# EAGLE design megajoltC (EAGLE 7.2.0)

## Sheet 1 of 6
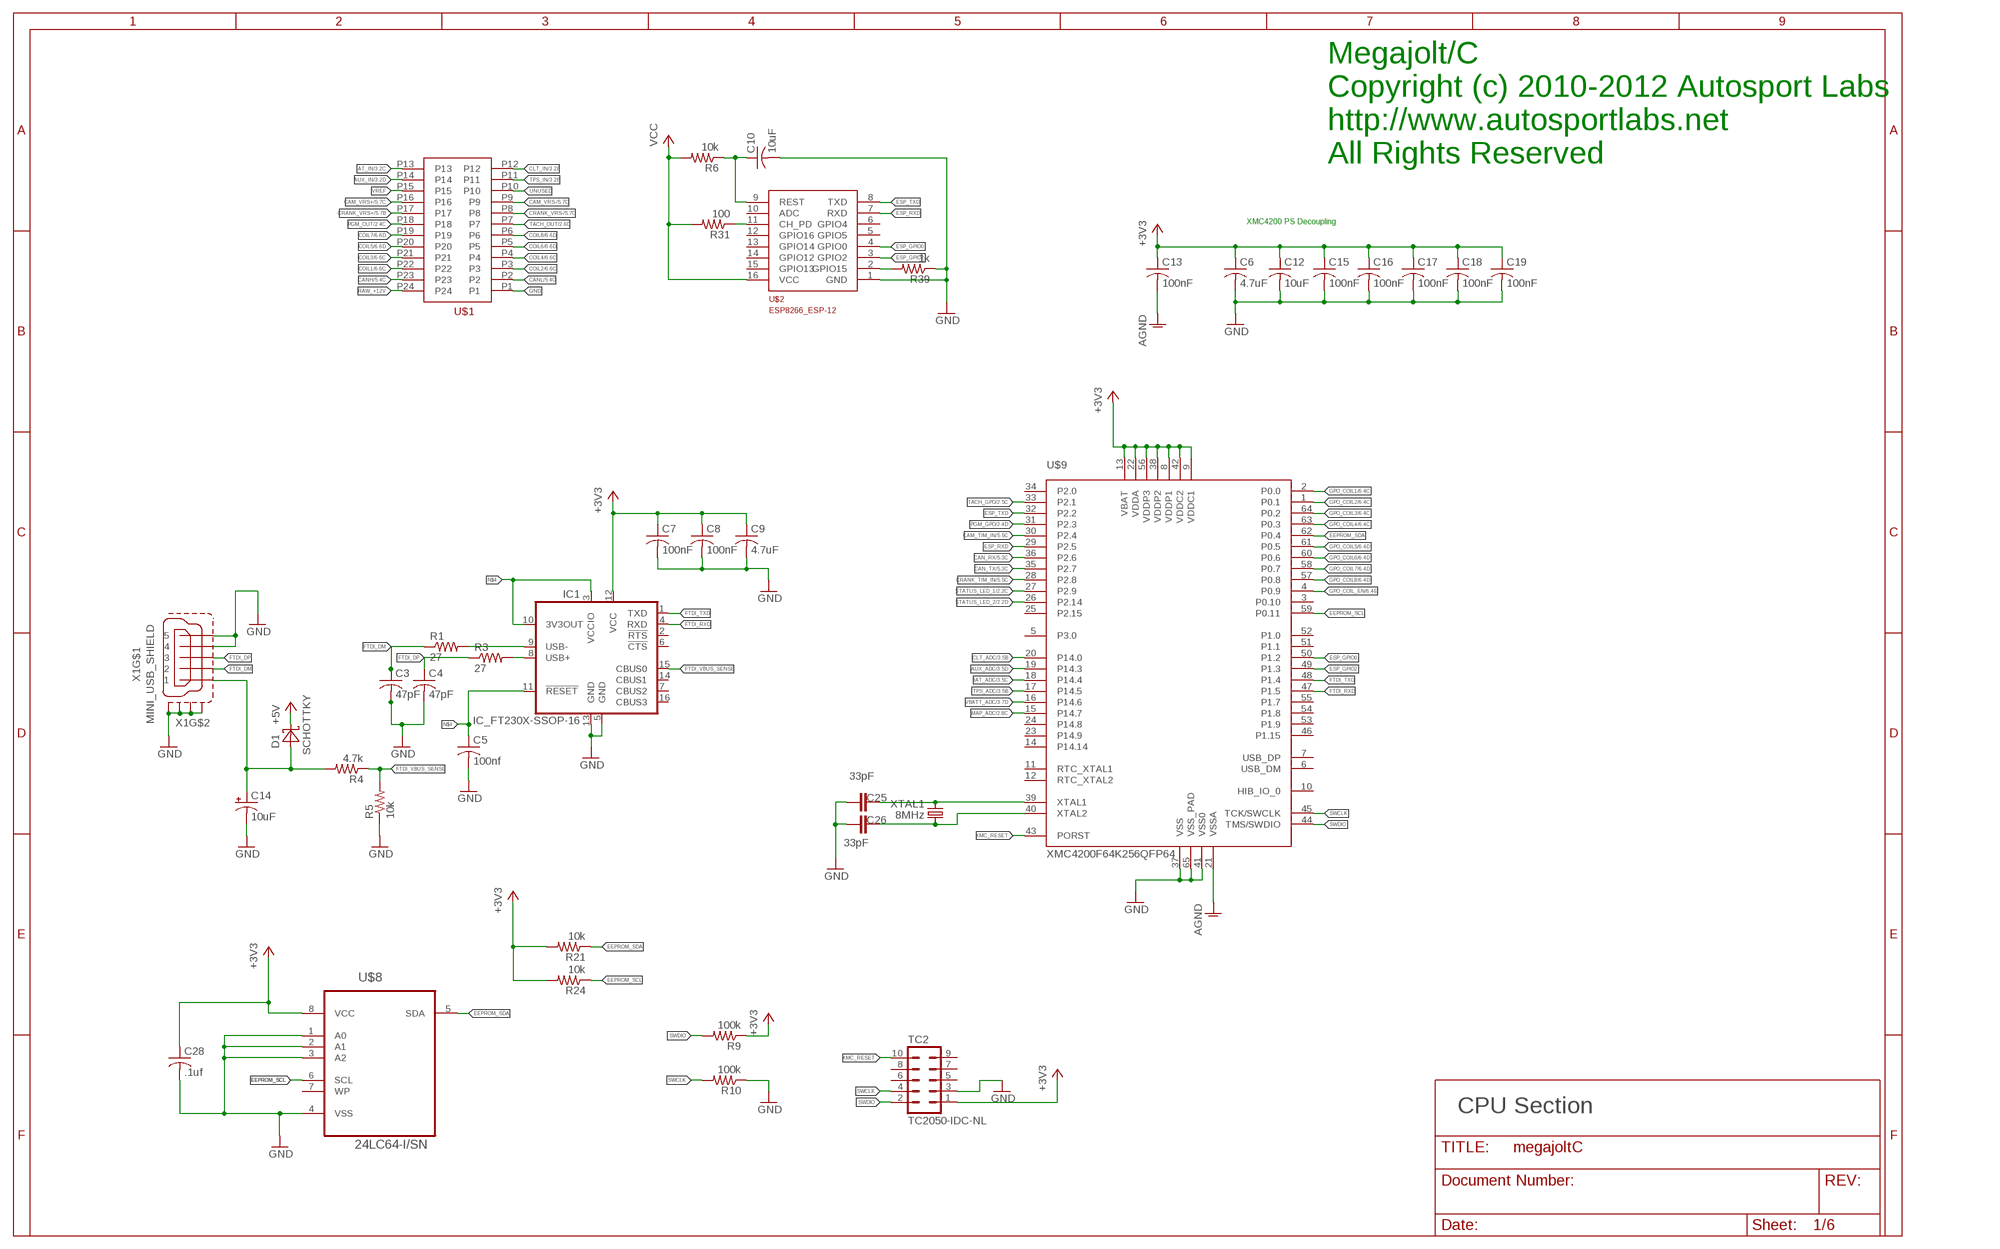
[diagram p0: schematic, sheet 1]

### Parts
C3  47pF  C-USC0603  [C0603]
C4  47pF  C-USC0603  [C0603]
C5  100nf  C-USC0603  [C0603]
C6  4.7uF  C-USC0603  [C0603]
C7  100nF  C-USC0603  [C0603]
C8  100nF  C-USC0603  [C0603]
C9  4.7uF  C-USC0603  [C0603]
C10  10uF  C-USC0603  [C0603]
C12  10uF  C-USC0603  [C0603]
C13  100nF  C-USC0603  [C0603]
C14  10uF  CPOL-USSMCA  [SMC_A]
C15  100nF  C-USC0603  [C0603]
C16  100nF  C-USC0603  [C0603]
C17  100nF  C-USC0603  [C0603]
C18  100nF  C-USC0603  [C0603]
C19  100nF  C-USC0603  [C0603]
C25  33pF  CAP0603  [0603]
C26  33pF  CAP0603  [0603]
C28  .1uf  C-USC0603  [C0603]
D1  SCHOTTKY  [SMA]
IC1  IC_FT230X-SSOP-16  [SSOP-16-FTDI]
R1  27  R-US_R0603  [R0603]
R3  27  R-US_R0603  [R0603]
R4  4.7k  R-US_R0603  [R0603]
R5  10k  R-US_R0603  [R0603]
R6  10k  R-US_R0603  [R0603]
R9  100k  R-US_R0603  [R0603]
R10  100k  R-US_R0603  [R0603]
R21  10k  R-US_R0603  [R0603]
R24  10k  R-US_R0603  [R0603]
R31  100  R-US_R0603  [R0603]
R39  1k  R-US_R0603  [R0603]
TC2  TC2050-IDC-NL  [TC2050-IDC-NL]
U$1  MOLEX_MINIFIT-JR-24  [MOLEX_MINIFIT-JR-24]
U$2  ESP8266_ESP-12  [ESP8266-ESP12]
U$8  24LC64-I/SN  [SOIC127P600X175-8N]
U$9  XMC4200F64K256QFP64  [INF-PG-LQFP-64-5800X5800T28]
X1  MINI_USB_SHIELD  [MINI-USB_JACK]
XTAL1  8MHz  CRYSTAL5X3  [CRYSTAL-SMD-5X3]

### Nets
+3V3: C6.1 C7.1 C8.1 C9.1 C12.1 C13.1 C15.1 C16.1 C17.1 C18.1 C19.1 C28.1 IC1.12(VCC) R9.1 R21.2 R24.2 TC2.1 U$8.8(VCC) U$9.8(VDDP1) U$9.9(VDDC1) U$9.13(VBAT) U$9.22(VDDA) U$9.38(VDDP2) U$9.42(VDDC2) U$9.56(VDDP3) ; also sheet 2,4
+5V: D1.C ; also sheet 2,3,4,5,6
AGND: C13.2 U$9.21(VSSA) ; also sheet 3,4
AUX_ADC: U$9.19(P14.3) ; also sheet 3
AUX_IN: U$1.P14 ; also sheet 3
CAM_TIM_IN: U$9.30(P2.4) ; also sheet 5
CAM_VRS+: U$1.P16 ; also sheet 5
CAM_VRS-: U$1.P9 ; also sheet 5
CAN_RX: U$9.36(P2.6) ; also sheet 5
CAN_TX: U$9.35(P2.7) ; also sheet 5
CANH: U$1.P23 ; also sheet 5
CANL: U$1.P2 ; also sheet 5
CLT_ADC: U$9.20(P14.0) ; also sheet 3
CLT_IN: U$1.P12 ; also sheet 3
COIL1: U$1.P22 ; also sheet 6
COIL2: U$1.P3 ; also sheet 6
COIL3: U$1.P21 ; also sheet 6
COIL4: U$1.P4 ; also sheet 6
COIL5: U$1.P20 ; also sheet 6
COIL6: U$1.P5 ; also sheet 6
COIL7: U$1.P19 ; also sheet 6
COIL8: U$1.P6 ; also sheet 6
CRANK_TIM_IN: U$9.28(P2.8) ; also sheet 5
CRANK_VRS+: U$1.P17 ; also sheet 5
CRANK_VRS-: U$1.P8 ; also sheet 5
EEPROM_SCL: R24.1 U$8.6(SCL) U$9.59(P0.11)
EEPROM_SDA: R21.1 U$8.5(SDA) U$9.62(P0.4)
ESP_GPIO0: U$2.4(GPIO0) U$9.50(P1.2)
ESP_GPIO2: U$2.3(GPIO2) U$9.49(P1.3)
ESP_RXD: U$2.7(RXD) U$9.29(P2.5)
ESP_TXD: U$2.8(TXD) U$9.32(P2.2)
FTDI_DM: C3.1 R1.1 X1.2
FTDI_DP: C4.1 R3.1 X1.3
FTDI_RXD: IC1.4(RXD) U$9.47(P1.5)
FTDI_TXD: IC1.1(TXD) U$9.48(P1.4)
FTDI_VBUS_SENSE: IC1.15(CBUS0) R4.1 R5.2
GND: C3.2 C4.2 C5.2 C6.2 C7.2 C8.2 C9.2 C10.2 C12.2 C14.- C15.2 C16.2 C17.2 C18.2 C19.2 C25.1 C26.1 C28.2 IC1.5(GND) IC1.13(GND) R5.1 R10.1 R39.1 TC2.3 U$1.P1 U$2.1(GND) U$8.1(A0) U$8.2(A1) U$8.3(A2) U$8.4(VSS) U$9.37(VSS) U$9.41(VSS0) U$9.65(VSS_PAD) X1.4 X1.5 X1.M1(S1) X1.M2(S2) X1.M3(S3) X1.M4(S4) ; also sheet 2,4,5,6
GPO_COIL1: U$9.2(P0.0) ; also sheet 6
GPO_COIL2: U$9.1(P0.1) ; also sheet 6
GPO_COIL3: U$9.64(P0.2) ; also sheet 6
GPO_COIL4: U$9.63(P0.3) ; also sheet 6
GPO_COIL5: U$9.61(P0.5) ; also sheet 6
GPO_COIL6: U$9.60(P0.6) ; also sheet 6
GPO_COIL7: U$9.58(P0.7) ; also sheet 6
GPO_COIL8: U$9.57(P0.8) ; also sheet 6
GPO_COIL_EN: U$9.4(P0.9) ; also sheet 6
IAT_ADC: U$9.18(P14.4) ; also sheet 3
IAT_IN: U$1.P13 ; also sheet 3
MAP_ADC: U$9.15(P14.7) ; also sheet 2
N$1: IC1.8(USB+) R3.2
N$3: IC1.9(USB-) R1.2
N$4: C5.1 IC1.3(VCCIO) IC1.10(3V3OUT) IC1.11(!RESET)
N$17: C10.1 R6.1 U$2.9(REST)
N$18: R31.1 U$2.11(CH_PD)
N$21: C26.2 U$9.40(XTAL2) XTAL1.1
N$24: R39.2 U$2.2(GPIO15)
N$25: C25.2 U$9.39(XTAL1) XTAL1.3
PGM_GPO: U$9.31(P2.3) ; also sheet 2
PGM_OUT: U$1.P18 ; also sheet 2
RAW_+12V: U$1.P24 ; also sheet 4
STATUS_LED_1: U$9.27(P2.9) ; also sheet 2
STATUS_LED_2: U$9.26(P2.14) ; also sheet 2
SWCLK: R10.2 TC2.4 U$9.45(TCK/SWCLK)
SWDIO: R9.2 TC2.2 U$9.44(TMS/SWDIO)
TACH_GPO: U$9.33(P2.1) ; also sheet 2
TACH_OUT: U$1.P7 ; also sheet 2
TPS_ADC: U$9.17(P14.5) ; also sheet 3
TPS_IN: U$1.P11 ; also sheet 3
UNUSED: U$1.P10
VBATT_ADC: U$9.16(P14.6) ; also sheet 3
VBUS: C14.+ D1.A R4.2 X1.1
VCC: R6.2 R31.2 U$2.16(VCC) ; also sheet 4
VREF: U$1.P15 ; also sheet 4
XMC_RESET: TC2.10 U$9.43(PORST)
Unconnected: IC1.2(!RTS) IC1.6(!CTS) IC1.7(CBUS2) IC1.14(CBUS1) IC1.16(CBUS3) TC2.5 TC2.6 TC2.7 TC2.8 TC2.9 U$2.5(GPIO5) U$2.6(GPIO4) U$2.10(ADC) U$2.12(GPIO16) U$2.13(GPIO14) U$2.14(GPIO12) U$2.15(GPIO13) U$8.7(WP) U$9.3(P0.10) U$9.5(P3.0) U$9.6(USB_DM) U$9.7(USB_DP) U$9.10(HIB_IO_0) U$9.11(RTC_XTAL1) U$9.12(RTC_XTAL2) U$9.14(P14.14) U$9.23(P14.9) U$9.24(P14.8) U$9.25(P2.15) U$9.34(P2.0) U$9.46(P1.15) U$9.51(P1.1) U$9.52(P1.0) U$9.53(P1.9) U$9.54(P1.8) U$9.55(P1.7)

### Notes on the sheet
- Megajolt/C
- Copyright (c) 2010-2012 Autosport Labs
- http://www.autosportlabs.net
- All Rights Reserved
- XMC4200 PS Decoupling
- CPU Section

## Sheet 2 of 6
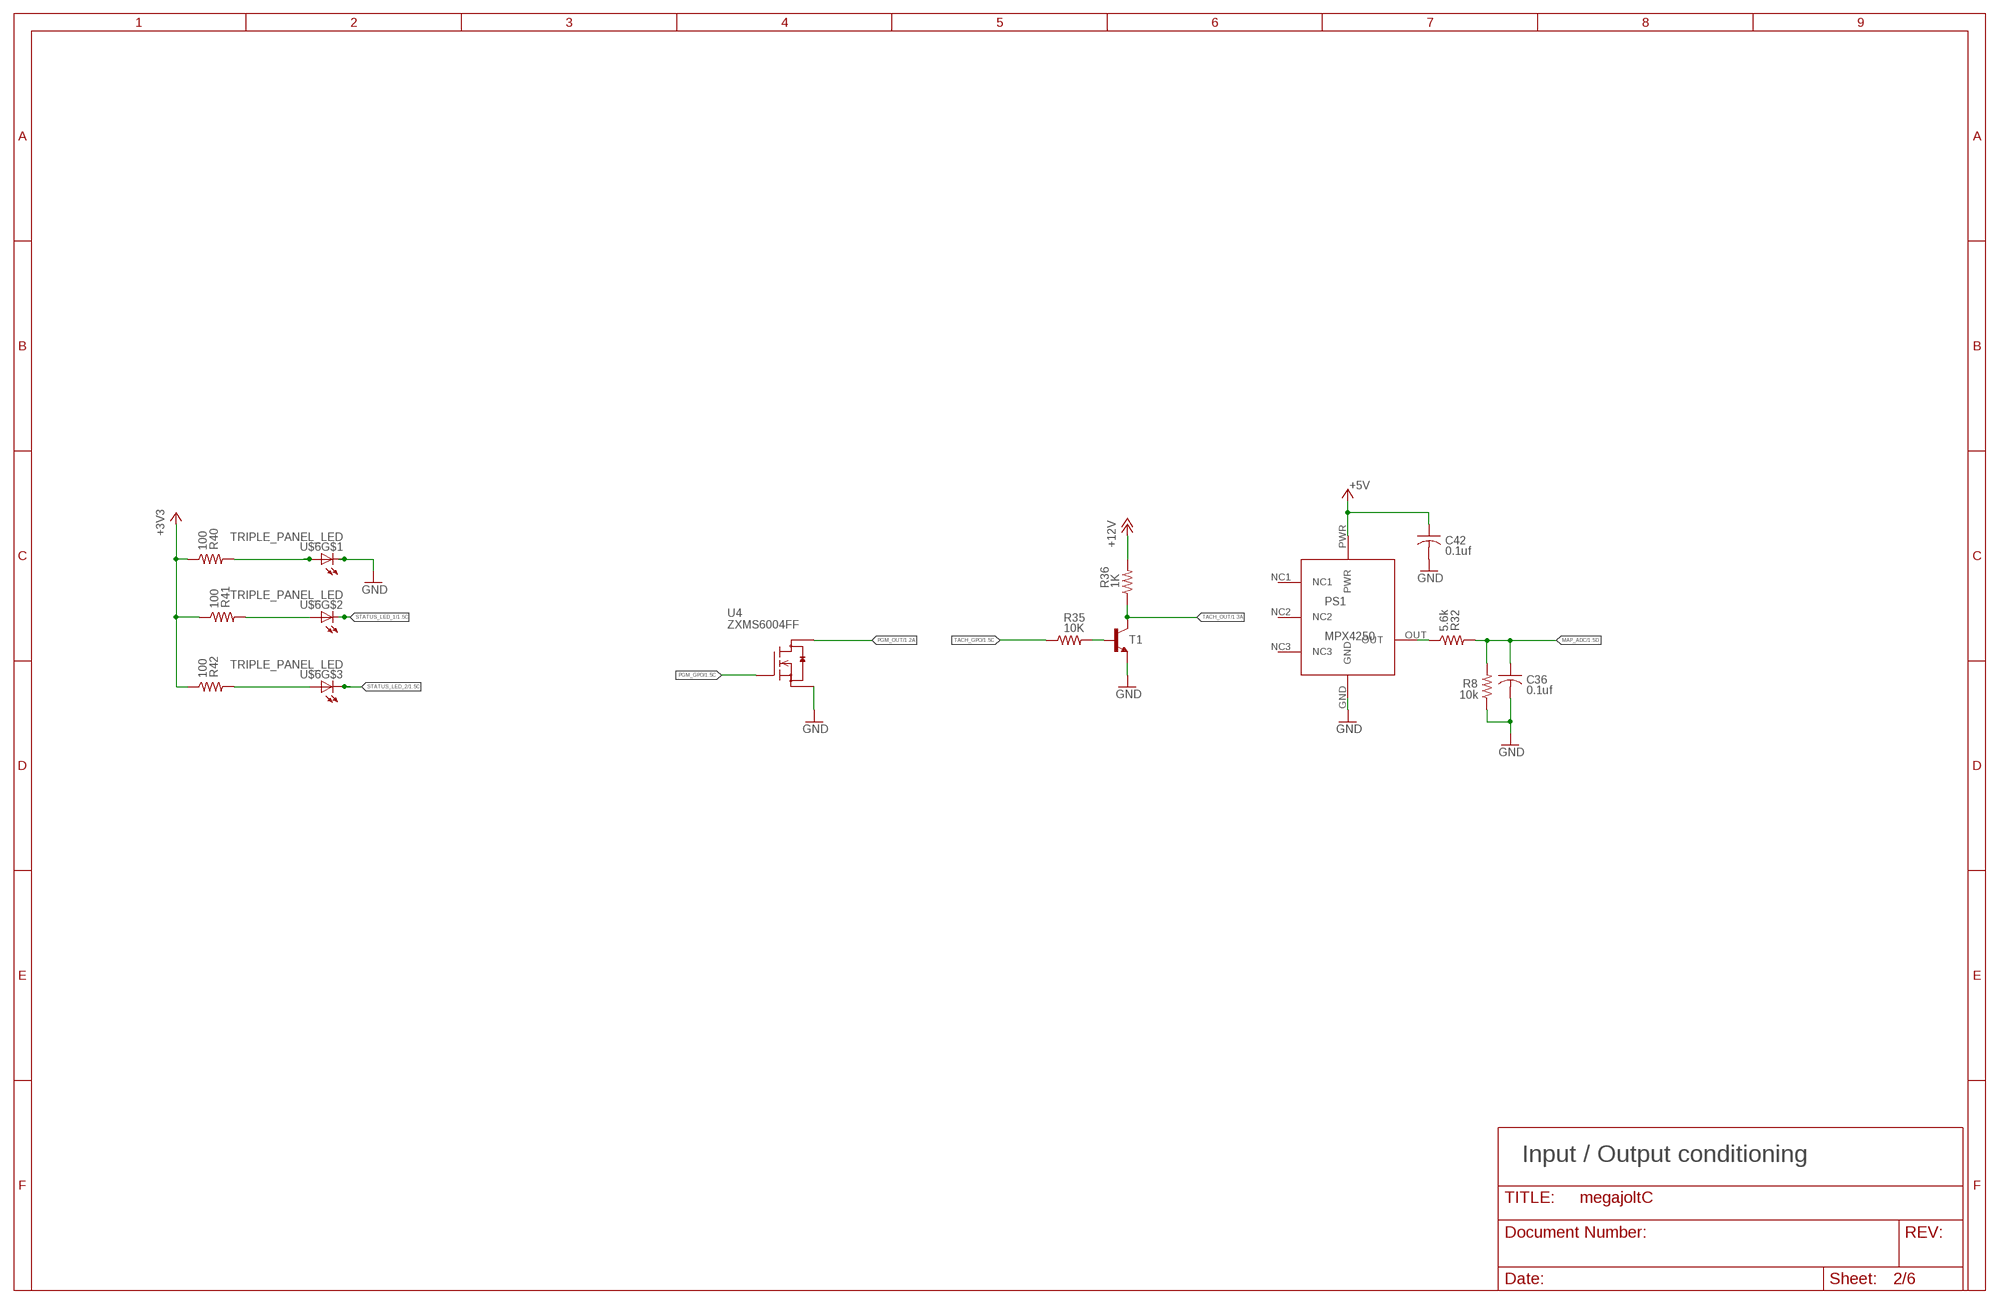
[diagram p1: schematic, sheet 2]

### Parts
C36  0.1uf  C-USC0603  [C0603]
C42  0.1uf  C-USC0603  [C0603]
PS1  MPX4250  [MPX4250]
R8  10k  R-US_R0603  [R0603]
R32  5.6k  R-US_R0603  [R0603]
R35  10K  R-US_R0603  [R0603]
R36  1K  R-US_R0603  [R0603]
R40  100  R-US_R0603  [R0603]
R41  100  R-US_R0603  [R0603]
R42  100  R-US_R0603  [R0603]
T1  -NPN-SOT23-EBC  [SOT23-EBC]
U4  ZXMS6004FF  [SOT-23]
U$6  TRIPLE_PANEL_LED  [RIGHT_ANGLE_3_LEDS_DEEP]

### Nets
+3V3: R40.1 R41.1 R42.1 ; also sheet 1,4
+5V: C42.1 PS1.PWR ; also sheet 1,3,4,5,6
GND: C36.2 C42.2 PS1.GND R8.1 T1.E U4.2(S1) U$6.2(C) ; also sheet 1,4,5,6
MAP_ADC: C36.1 R8.2 R32.2 ; also sheet 1
N$7: PS1.OUT R32.1
N$16: R35.2 T1.B
N$20: R40.2 U$6.1(A)
N$22: R41.2 U$6.3(A)
N$23: R42.2 U$6.5(A)
PGM_GPO: U4.1(G) ; also sheet 1
PGM_OUT: U4.3(D1) ; also sheet 1
SAFE_+12V: R36.2 ; supply symbol labelled +12V ; also sheet 3,4
STATUS_LED_1: U$6.4(C) ; also sheet 1
STATUS_LED_2: U$6.6(C) ; also sheet 1
TACH_GPO: R35.1 ; also sheet 1
TACH_OUT: R36.1 T1.C ; also sheet 1

### Notes on the sheet
- Input / Output conditioning

## Sheet 3 of 6
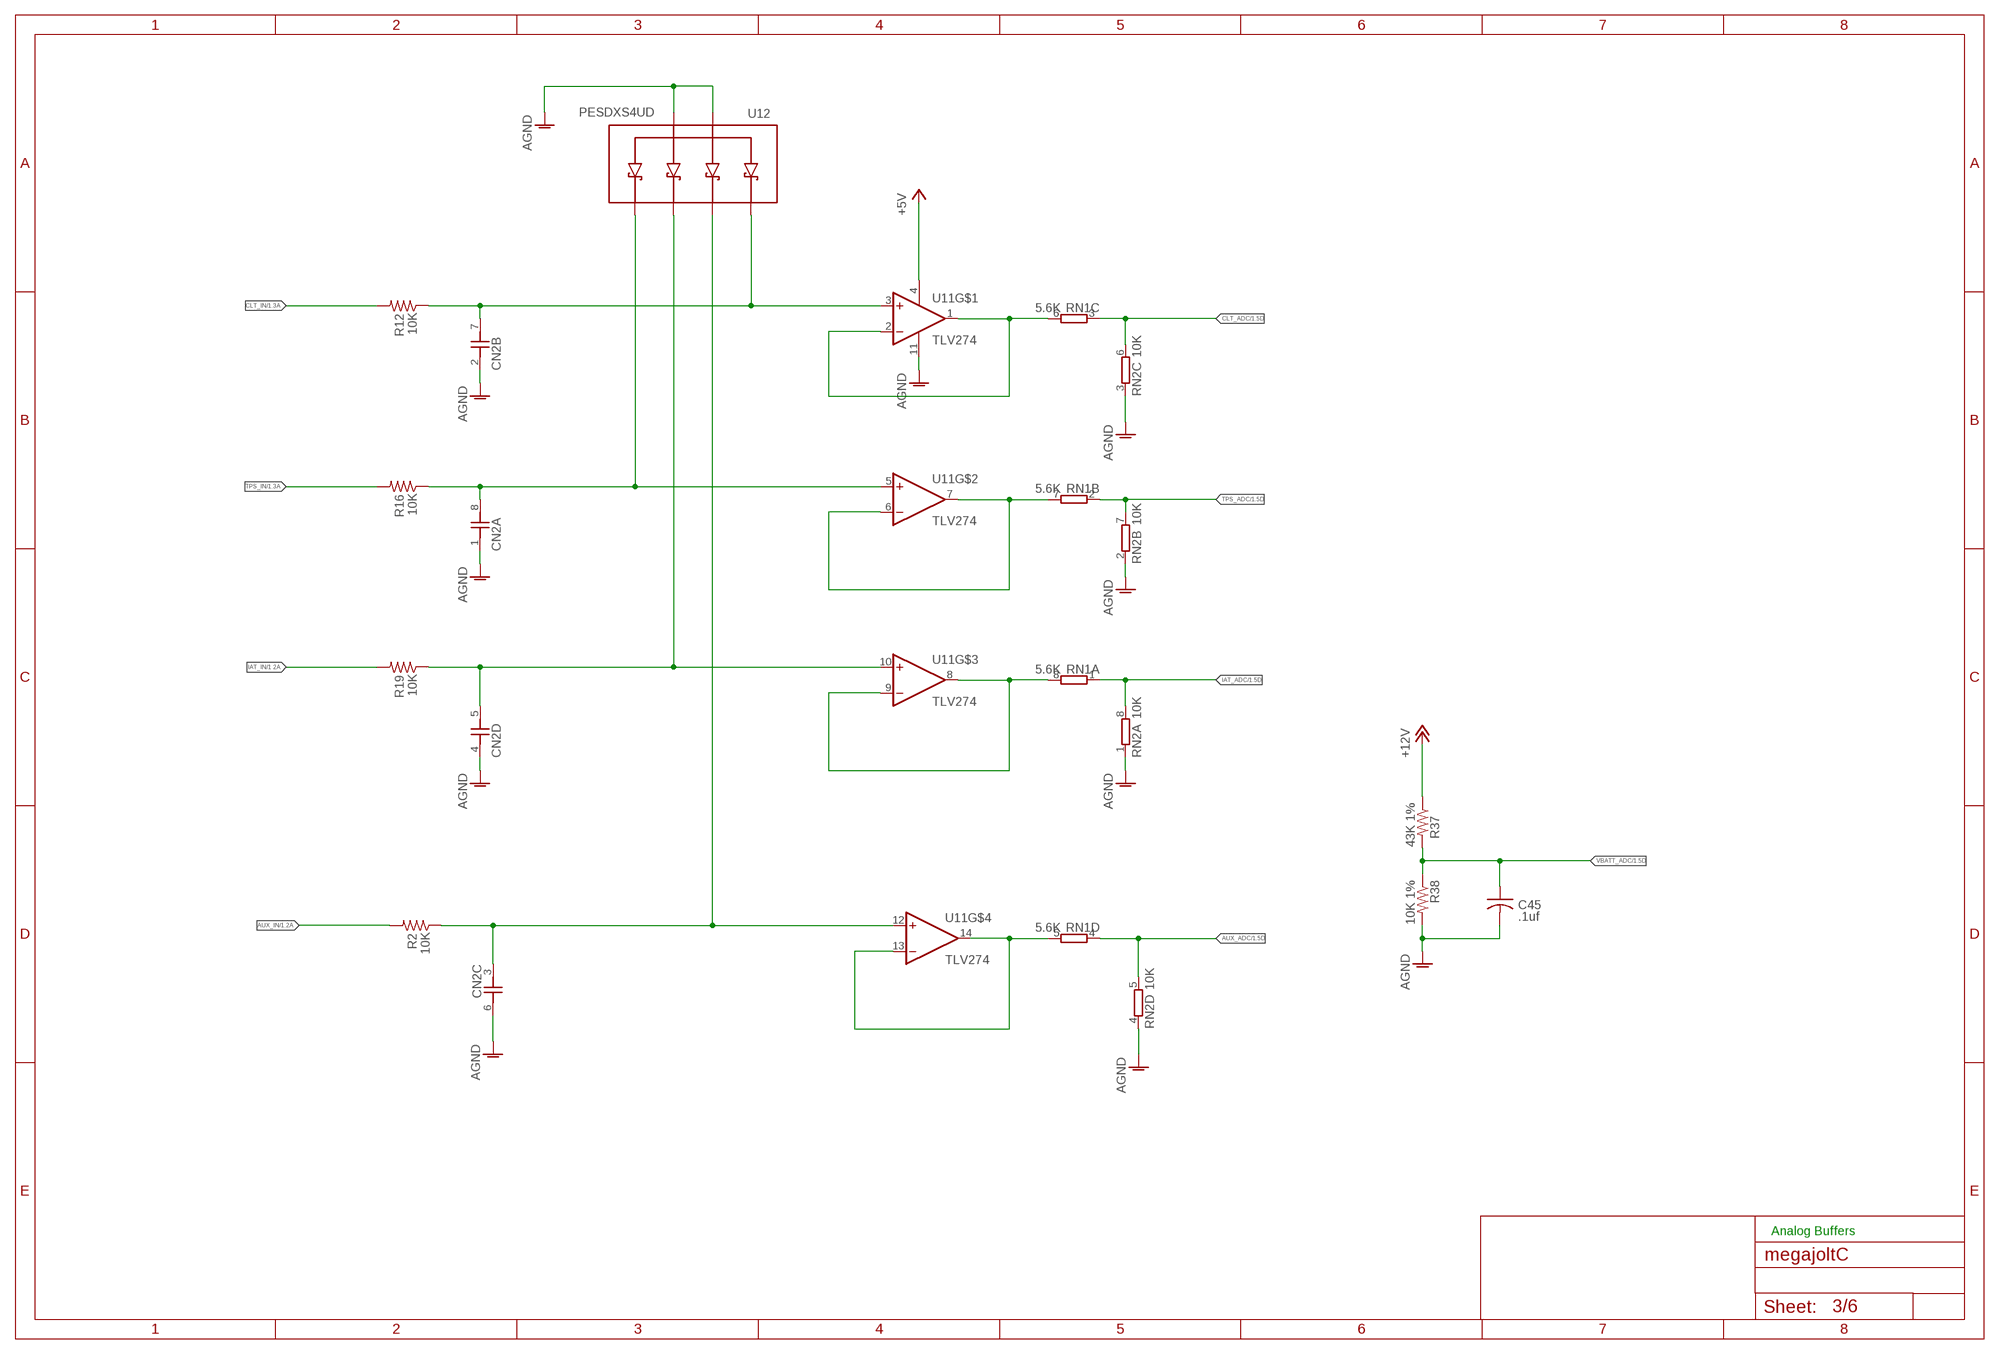
[diagram p2: schematic, sheet 3]

### Parts
C45  .1uf  C-USC0603  [C0603]
CN2  CAP_ARRAY_41206_ARRAY  [1206_ARRAY]
R2  10K  R-US_R1206  [R1206]
R12  10K  R-US_R1206  [R1206]
R16  10K  R-US_R1206  [R1206]
R19  10K  R-US_R1206  [R1206]
R37  43K 1%  R-US_R0603  [R0603]
R38  10K 1%  R-US_R0603  [R0603]
RN1  5.6K  4R-N0603-ARC  [0603-ARC]
RN2  10K  4R-N0603-ARC  [0603-ARC]
U11  TLV274  TLV274SO14  [SO14]
U12  PESDXS4UD  [SC-74]

### Nets
+5V: U11.4(V+) ; also sheet 1,2,4,5,6
AGND: C45.2 CN2.1 CN2.2 CN2.4 CN2.6 R38.2 RN2.1 RN2.2 RN2.3 RN2.4 U11.11(V-) U12.2 U12.5 ; also sheet 1,4
ANALOG-FREQ_1_OPAMP_OUT1: RN1.6 U11.1(OUT) U11.2(-IN)
ANALOG-FREQ_1_OPAMP_OUT2: RN1.7 U11.6(-IN) U11.7(OUT)
ANALOG-FREQ_1_OPAMP_OUT3: RN1.8 U11.8(OUT) U11.9(-IN)
AUX_ADC: RN1.4 RN2.5 ; also sheet 1
AUX_IN: R2.2 ; also sheet 1
CLT_ADC: RN1.3 RN2.6 ; also sheet 1
CLT_IN: R12.2 ; also sheet 1
IAT_ADC: RN1.1 RN2.8 ; also sheet 1
IAT_IN: R19.2 ; also sheet 1
N$14: RN1.5 U11.13(-IN) U11.14(OUT)
N$26: CN2.7 R12.1 U11.3(+IN) U12.1
N$28: CN2.8 R16.1 U11.5(+IN) U12.6
N$30: CN2.5 R19.1 U11.10(+IN) U12.4
N$31: CN2.3 R2.1 U11.12(+IN) U12.3
SAFE_+12V: R37.1 ; supply symbol labelled +12V ; also sheet 2,4
TPS_ADC: RN1.2 RN2.7 ; also sheet 1
TPS_IN: R16.2 ; also sheet 1
VBATT_ADC: C45.1 R37.2 R38.1 ; also sheet 1

### Notes on the sheet
- Analog Buffers

## Sheet 4 of 6
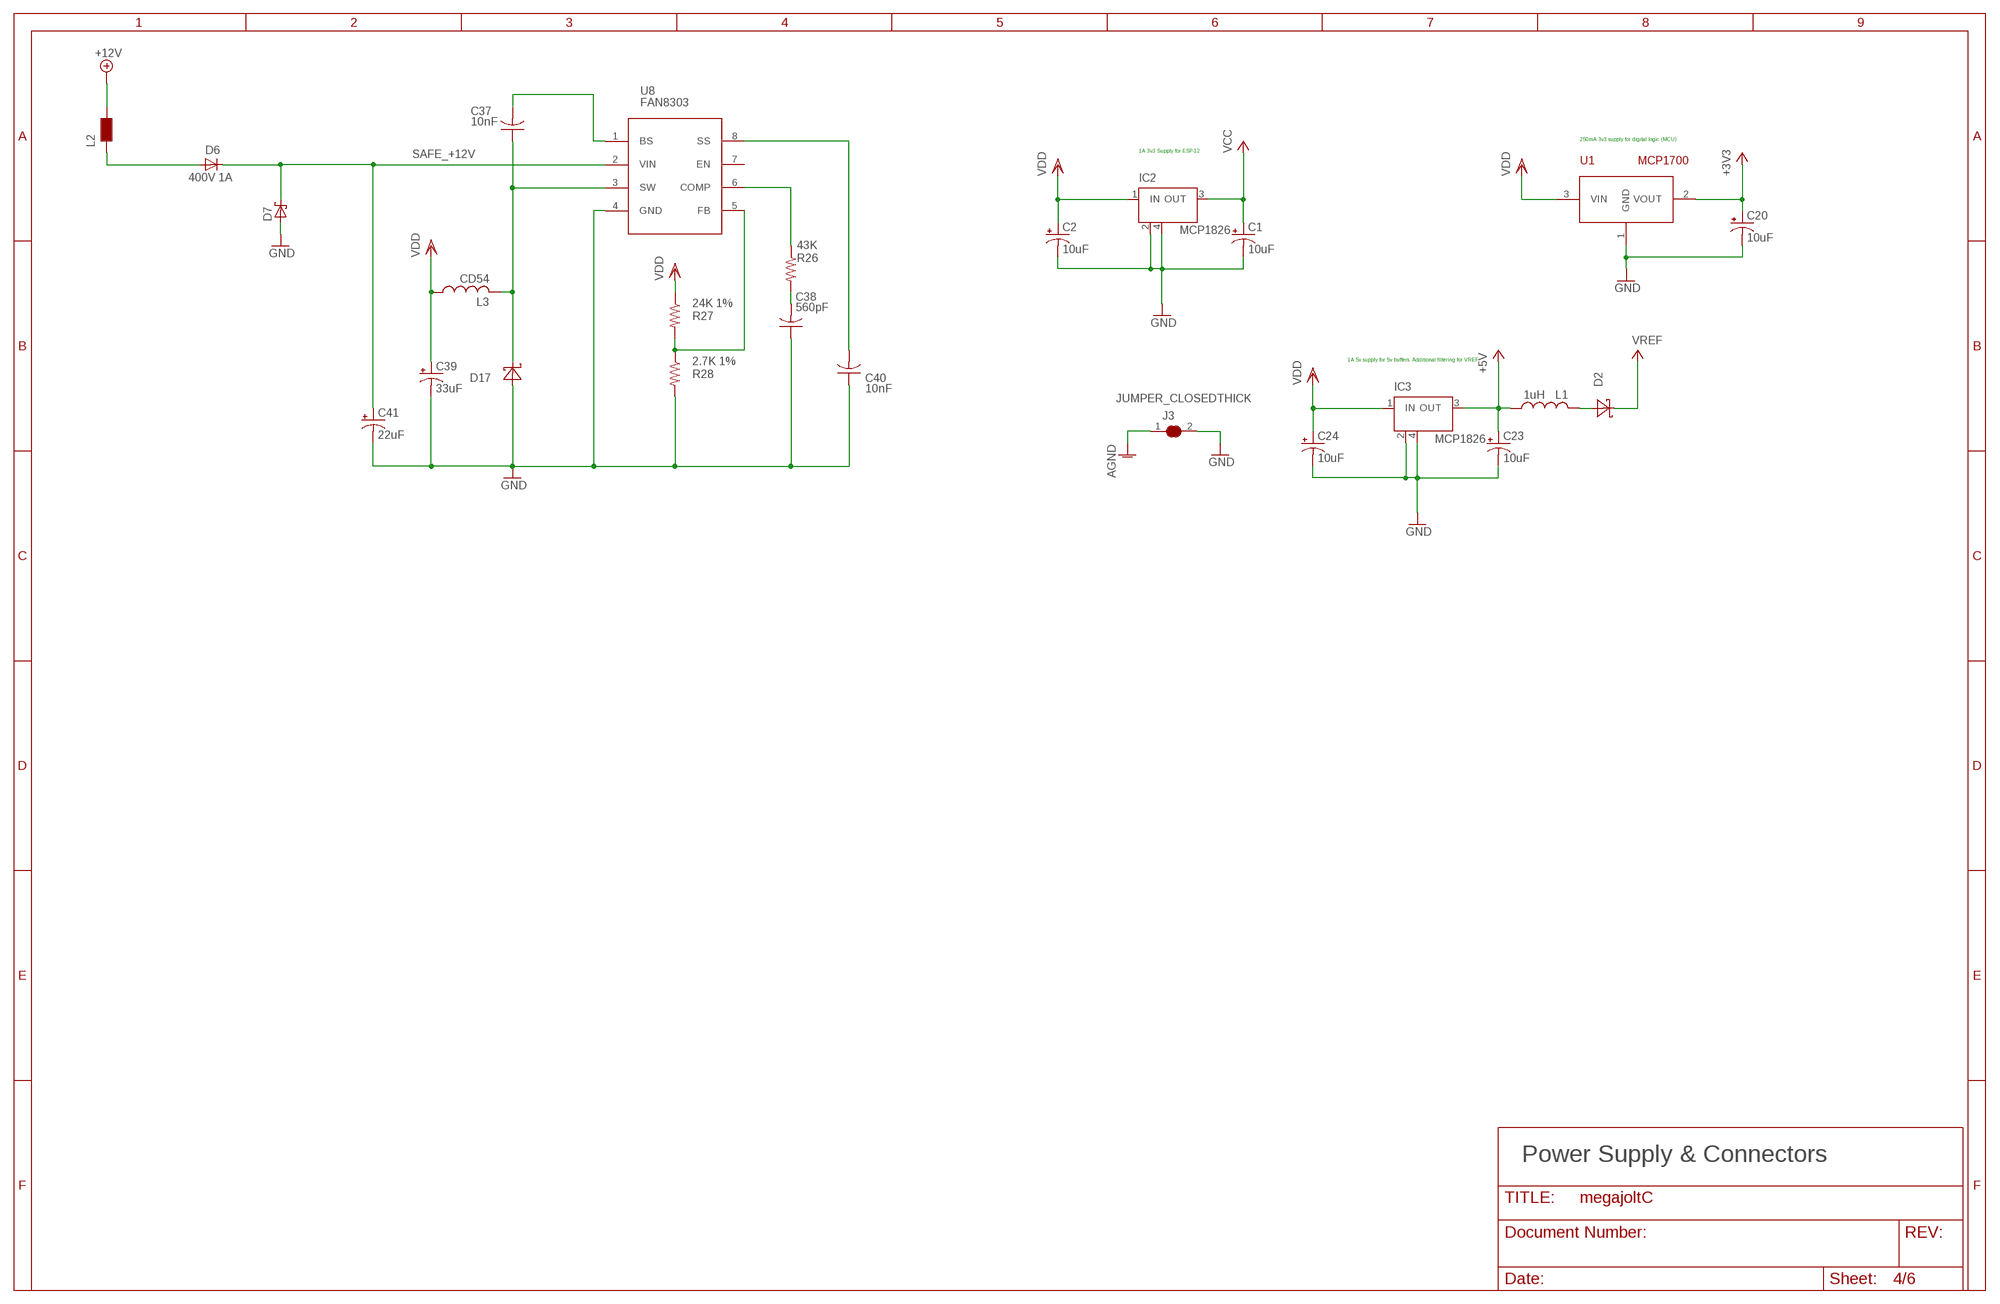
[diagram p3: schematic, sheet 4]

### Parts
C1  10uF  CPOL-USSMCA  [SMC_A]
C2  10uF  CPOL-USSMCA  [SMC_A]
C20  10uF  CPOL-USSMCA  [SMC_A]
C23  10uF  CPOL-USSMCA  [SMC_A]
C24  10uF  CPOL-USSMCA  [SMC_A]
C37  10nF  C-USC0603  [C0603]
C38  560pF  C-USC0603  [C0603]
C39  33uF  CPOL-USSMCD  [SMC_D]
C40  10nF  C-USC0603  [C0603]
C41  22uF  CPOL-US153CLV-0605  [153CLV-0605]
D2  SCHOTTKY  [SMA]
D6  400V 1A  DIODE1  [SMA]
D7  SCHOTTKY-DIODESMC  [SMC]
D17  SCHOTTKY  [SMA]
IC2  MCP1826  LM340S  [SOT223]
IC3  MCP1826  LM340S  [SOT223]
J3  JUMPER_CLOSEDTHICK  [JUMPER_CLOSED_THICK]
L1  1uH  INDUCTOR  [1210]
L2  WE-CBF_1812  [1812]
L3  CD54  [CD54]
R26  43K  R-US_R0603  [R0603]
R27  24K 1%  R-US_R0603  [R0603]
R28  2.7K 1%  R-US_R0603  [R0603]
U1  MCP1700  [SOT-23]
U8  FAN8303  [SO-8]

### Nets
+3V3: C20.+ U1.2(VOUT) ; also sheet 1,2
+5V: C23.+ IC3.3(OUT) L1.1 ; also sheet 1,2,3,5,6
AGND: J3.1 ; also sheet 1,3
GND: C1.- C2.- C20.- C23.- C24.- C38.1 C39.- C40.1 C41.- D7.A D17.A IC2.2(GND) IC2.4(GND) IC3.2(GND) IC3.4(GND) J3.2 R28.2 U1.1(GND) U8.4(GND) ; also sheet 1,2,5,6
N$2: D2.A L1.2
N$8: R27.2 R28.1 U8.5(FB)
N$9: C37.2 U8.1(BS)
N$10: C37.1 D17.C L3.P$2 U8.3(SW)
N$11: C38.2 R26.2
N$12: R26.1 U8.6(COMP)
N$13: C40.2 U8.8(SS)
N$15: D6.A L2.1
RAW_+12V: L2.2 ; supply symbol labelled +12V ; also sheet 1
SAFE_+12V: C41.+ D6.C D7.C U8.2(VIN) ; also sheet 2,3
VCC: C1.+ IC2.3(OUT) ; also sheet 1
VDD: C2.+ C24.+ C39.+ IC2.1(IN) IC3.1(IN) L3.P$1 R27.1 U1.3(VIN)
VREF: D2.C ; also sheet 1
Unconnected: U8.7(EN)

### Notes on the sheet
- 250mA 3v3 supply for digital logic (MCU)
- 1A 3v3 Supply for ESP-12
- 1A 5v supply for 5v buffers. Additional filtering for VREF
- Power Supply & Connectors

## Sheet 5 of 6
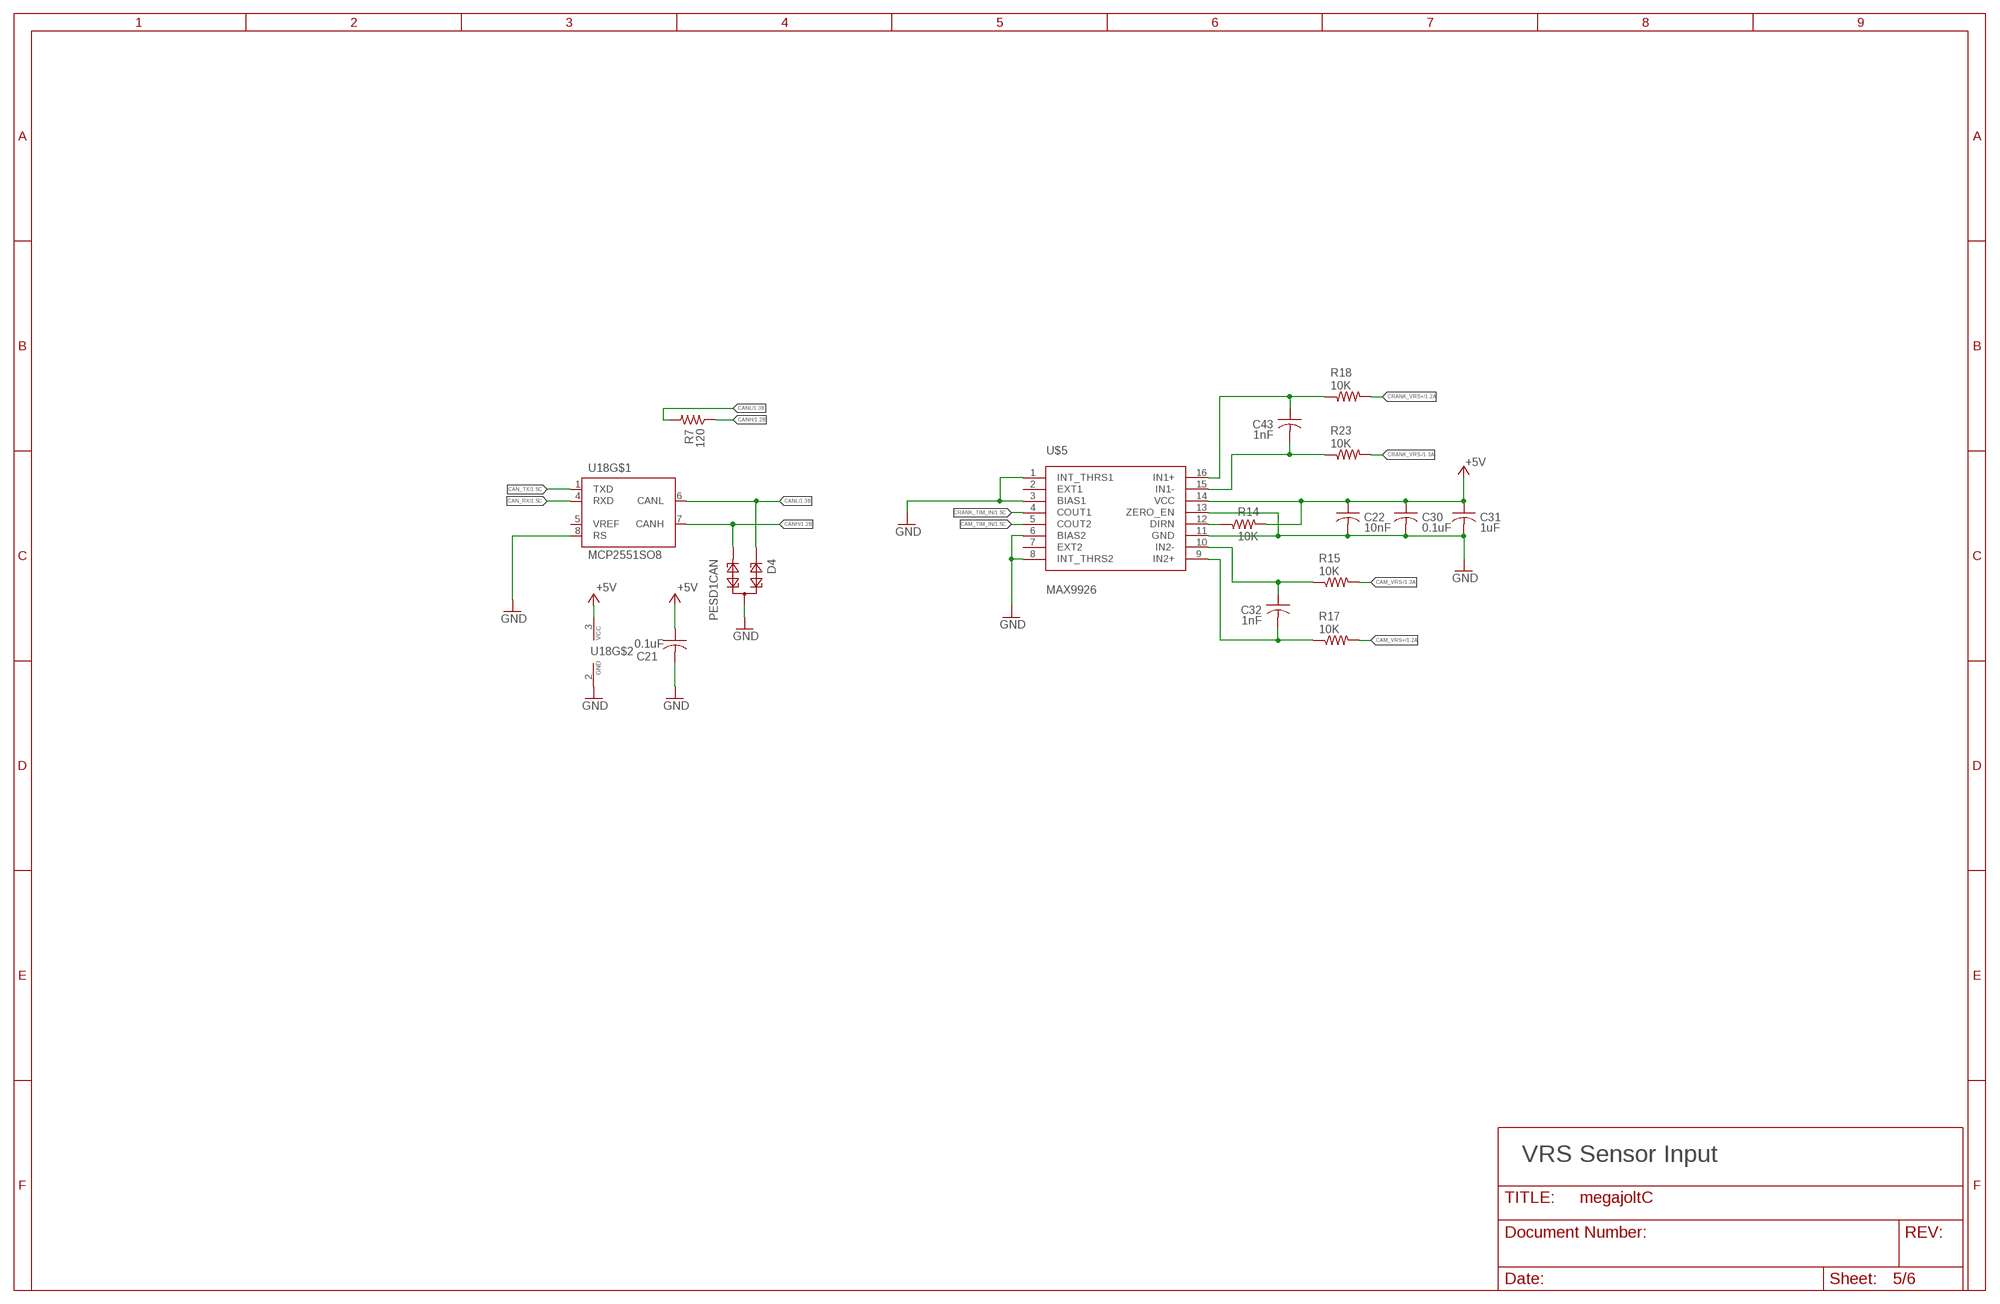
[diagram p4: schematic, sheet 5]

### Parts
C21  0.1uF  C-USC0603K  [C0603K]
C22  10nF  C-USC0603  [C0603]
C30  0.1uF  C-USC0603  [C0603]
C31  1uF  C-USC0603  [C0603]
C32  1nF  C-USC0603  [C0603]
C43  1nF  C-USC0603  [C0603]
D4  PESD1CAN  [SOT23]
R7  120  R-US_R0603  [R0603]
R14  10K  R-US_R0603  [R0603]
R15  10K  R-US_R0603  [R0603]
R17  10K  R-US_R0603  [R0603]
R18  10K  R-US_R0603  [R0603]
R23  10K  R-US_R0603  [R0603]
U18  MCP2551SO8  [SO08]
U$5  MAX9926  [QSOP16]

### Nets
+5V: C21.1 C22.1 C30.1 C31.1 R14.2 U18.3(VCC) U$5.14(VCC) ; also sheet 1,2,3,4,6
CAM_TIM_IN: U$5.5(COUT2) ; also sheet 1
CAM_VRS+: R17.2 ; also sheet 1
CAM_VRS-: R15.2 ; also sheet 1
CAN_RX: U18.4(RXD) ; also sheet 1
CAN_TX: U18.1(TXD) ; also sheet 1
CANH: D4.2 R7.1 U18.7(CANH) ; also sheet 1
CANL: D4.1 R7.2 U18.6(CANL) ; also sheet 1
CRANK_TIM_IN: U$5.4(COUT1) ; also sheet 1
CRANK_VRS+: R18.2 ; also sheet 1
CRANK_VRS-: R23.2 ; also sheet 1
GND: C21.2 C22.2 C30.2 C31.2 D4.3 U18.2(GND) U18.8(RS) U$5.1(INT_THRS1) U$5.3(BIAS1) U$5.6(BIAS2) U$5.8(INT_THRS2) U$5.11(GND) U$5.13(ZERO_EN) ; also sheet 1,2,4,6
MAX_DIRN: R14.1 U$5.12(DIRN)
N$27: C43.1 R18.1 U$5.16(IN1+)
N$29: C32.1 R15.1 U$5.10(IN2-)
N$32: C32.2 R17.1 U$5.9(IN2+)
N$33: C43.2 R23.1 U$5.15(IN1-)
Unconnected: U18.5(VREF) U$5.2(EXT1) U$5.7(EXT2)

### Notes on the sheet
- VRS Sensor Input

## Sheet 6 of 6
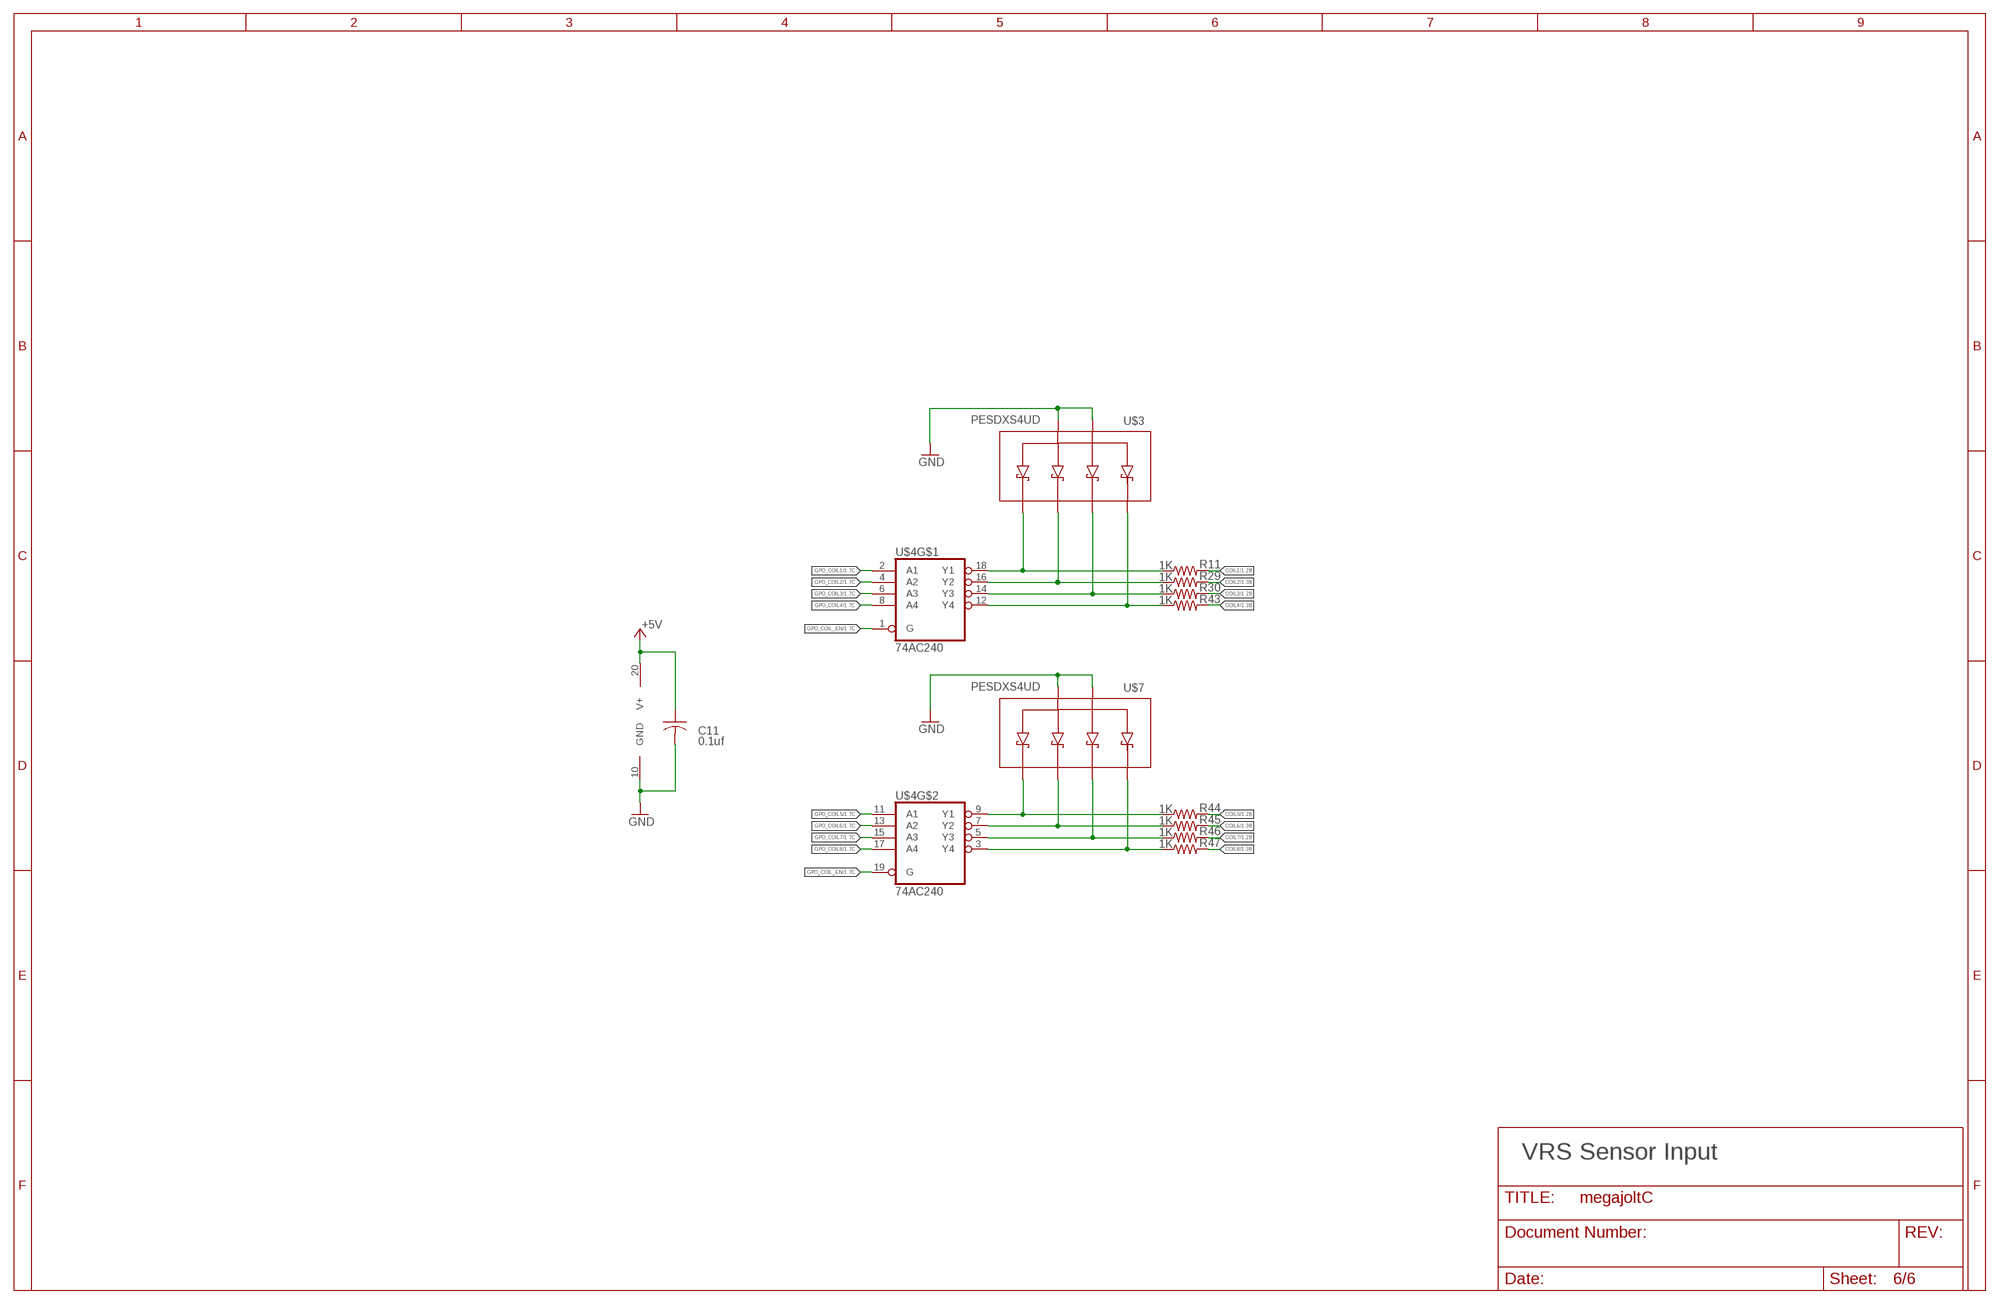
[diagram p5: schematic, sheet 6]

### Parts
C11  0.1uf  C-USC0603  [C0603]
R11  1K  R-US_R0603  [R0603]
R29  1K  R-US_R0603  [R0603]
R30  1K  R-US_R0603  [R0603]
R43  1K  R-US_R0603  [R0603]
R44  1K  R-US_R0603  [R0603]
R45  1K  R-US_R0603  [R0603]
R46  1K  R-US_R0603  [R0603]
R47  1K  R-US_R0603  [R0603]
U$3  PESDXS4UD  [SC-74]
U$4  74AC240  [TSSOP-20]
U$7  PESDXS4UD  [SC-74]

### Nets
+5V: C11.1 U$4.20(V+) ; also sheet 1,2,3,4,5
COIL1: R11.2 ; also sheet 1
COIL2: R29.2 ; also sheet 1
COIL3: R30.2 ; also sheet 1
COIL4: R43.2 ; also sheet 1
COIL5: R44.2 ; also sheet 1
COIL6: R45.2 ; also sheet 1
COIL7: R46.2 ; also sheet 1
COIL8: R47.2 ; also sheet 1
GND: C11.2 U$3.2 U$3.5 U$4.10(GND) U$7.2 U$7.5 ; also sheet 1,2,4,5
GPO_COIL1: U$4.2(A1) ; also sheet 1
GPO_COIL2: U$4.4(A2) ; also sheet 1
GPO_COIL3: U$4.6(A3) ; also sheet 1
GPO_COIL4: U$4.8(A4) ; also sheet 1
GPO_COIL5: U$4.11(A1) ; also sheet 1
GPO_COIL6: U$4.13(A2) ; also sheet 1
GPO_COIL7: U$4.15(A3) ; also sheet 1
GPO_COIL8: U$4.17(A4) ; also sheet 1
GPO_COIL_EN: U$4.1(G) U$4.19(G) ; also sheet 1
N$36: R11.1 U$3.6 U$4.18(Y1)
N$37: R29.1 U$3.4 U$4.16(Y2)
N$38: R30.1 U$3.3 U$4.14(Y3)
N$39: R43.1 U$3.1 U$4.12(Y4)
N$40: R44.1 U$4.9(Y1) U$7.6
N$41: R45.1 U$4.7(Y2) U$7.4
N$42: R46.1 U$4.5(Y3) U$7.3
N$43: R47.1 U$4.3(Y4) U$7.1

### Notes on the sheet
- VRS Sensor Input

## Power pins joined to a net without a drawn wire
NC1: PS1.NC1
NC2: PS1.NC2
NC3: PS1.NC3

## Library data of the parts
C1 C2 C14 C20 C23 C24 C39 C41 = rcl:CPOL-US: POLARIZED CAPACITOR, American symbol
C3-C10 C12 C13 C15-C19 C28 = resistor:C-US: CAPACITOR, American symbol
C11 C21 C22 C30-C32 C36-C38 C40 C42 C43 C45 = rcl:C-US: CAPACITOR, American symbol
C25 C26 = SparkFun:CAP: Capacitor Standard 0603 ceramic capacitor, and 0.1" leaded capacitor.
CN2 = cap_array:CAP_ARRAY_4
D1 D2 D17 = smt_diodes:SCHOTTKY
D4 = diode:PESD1CAN: CAN bus ESD protection diode Source: http://www.nxp.com/documents/data_sheet/PESD1CAN.pdf
D6 = smt_diodes:DIODE
D7 = diode:SCHOTTKY-DIODE: Schottky Diode
IC1 = dp_devices:IC_FT230X: BASIC USB to UART IC
IC2 IC3 = linear:LM340S: 3-Terminal Positive Regulators Source: http://cache.national.com/ds/LM/LM340.pdf
J3 = jumpers:JUMPER_CLOSED
L1 = smt_inductors:INDUCTOR
L2 = wuerth-elektronik:WE-CBF: SMD EMI Suppression Ferrite Beads - excellent anti-EMI properties - low DCR - impedances till 3000 ohms - rated current up to 6 A
L3 = sumida_inductors:CD54
PS1 = pressure_sensor:MPX4250
R1 R3-R6 R9 R10 R21 R24 R31 R39 = resistor:R-US_: RESISTOR, American symbol
R2 R7 R8 R11 R12 R14-R19 R23 R26-R30 R32 R35-R38 R40-R47 = rcl:R-US_: RESISTOR, American symbol
RN1 RN2 = resistor-dil:4R-N: Array Chip Resistor Source: RS Component / Phycomp
T1 = transistor:*-NPN-: NPN Transistror BF959 corrected 2008.03.06
TC2 = TagConnect:TC2050-IDC: Tag-Connect In Circuit Programming & Debug Cable 10 Pin http://www.tag-connect.com
U1 = mcp1700:MCP1700
U4 = power_mosfets:ZXMS6004FF
U8 = voltage_regulators:FAN8303
U11 = op_amps:TLV274
U12 U$3 U$7 = smt_diodes:PESDXS4UD
U18 = can:MCP2551: CAN Tranceiver Microchip
U$1 = molex_mini-fit:MOLEX_MINIFIT-JR-24
U$2 = ESP8266-ESP12:ESP8266_ESP-12
U$4 = dp_devices:74AC240
U$5 = max9924_9927:MAX9926: Maxim MAX9926 dual channel VR Controller
U$6 = LEDs:TRIPLE_PANEL_LED
U$8 = element14_microchip:24LC64-I/SN: 64K I2C Serial EEPROM; MPN: 24LC64-I/SN; OC_FARNELL: 9758070; OC_NEWARK: 12C2020; PACKAGE: SOIC-8; SUPPLIER: MICROCHIP
U$9 = infineon_xmc:XMC4200F64K256
X1 = cnkls_parts:MINI_USB_SHIELD
XTAL1 = SparkFun2:CRYSTAL: Crystals Various standard crystals. Proven footprints. Spark Fun Electronics SKU : COM-00534

## Net classes
0 default: width 0.127 mm, drill 0.254 mm, clearance 0.127 mm

## Board
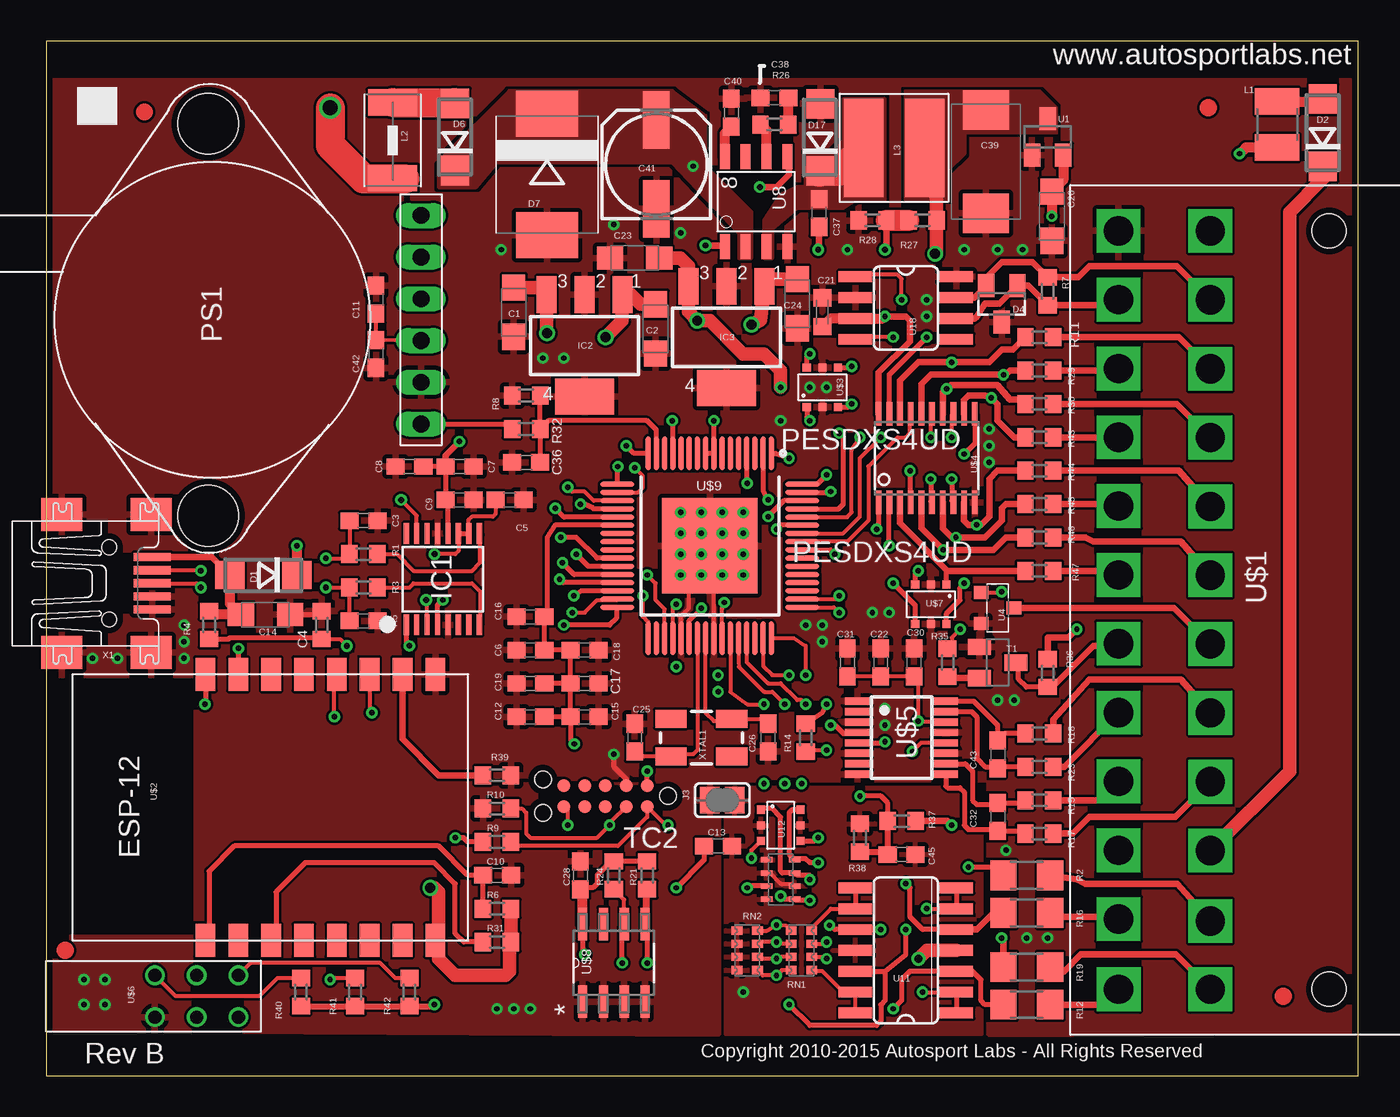
[diagram p6: board, top side]
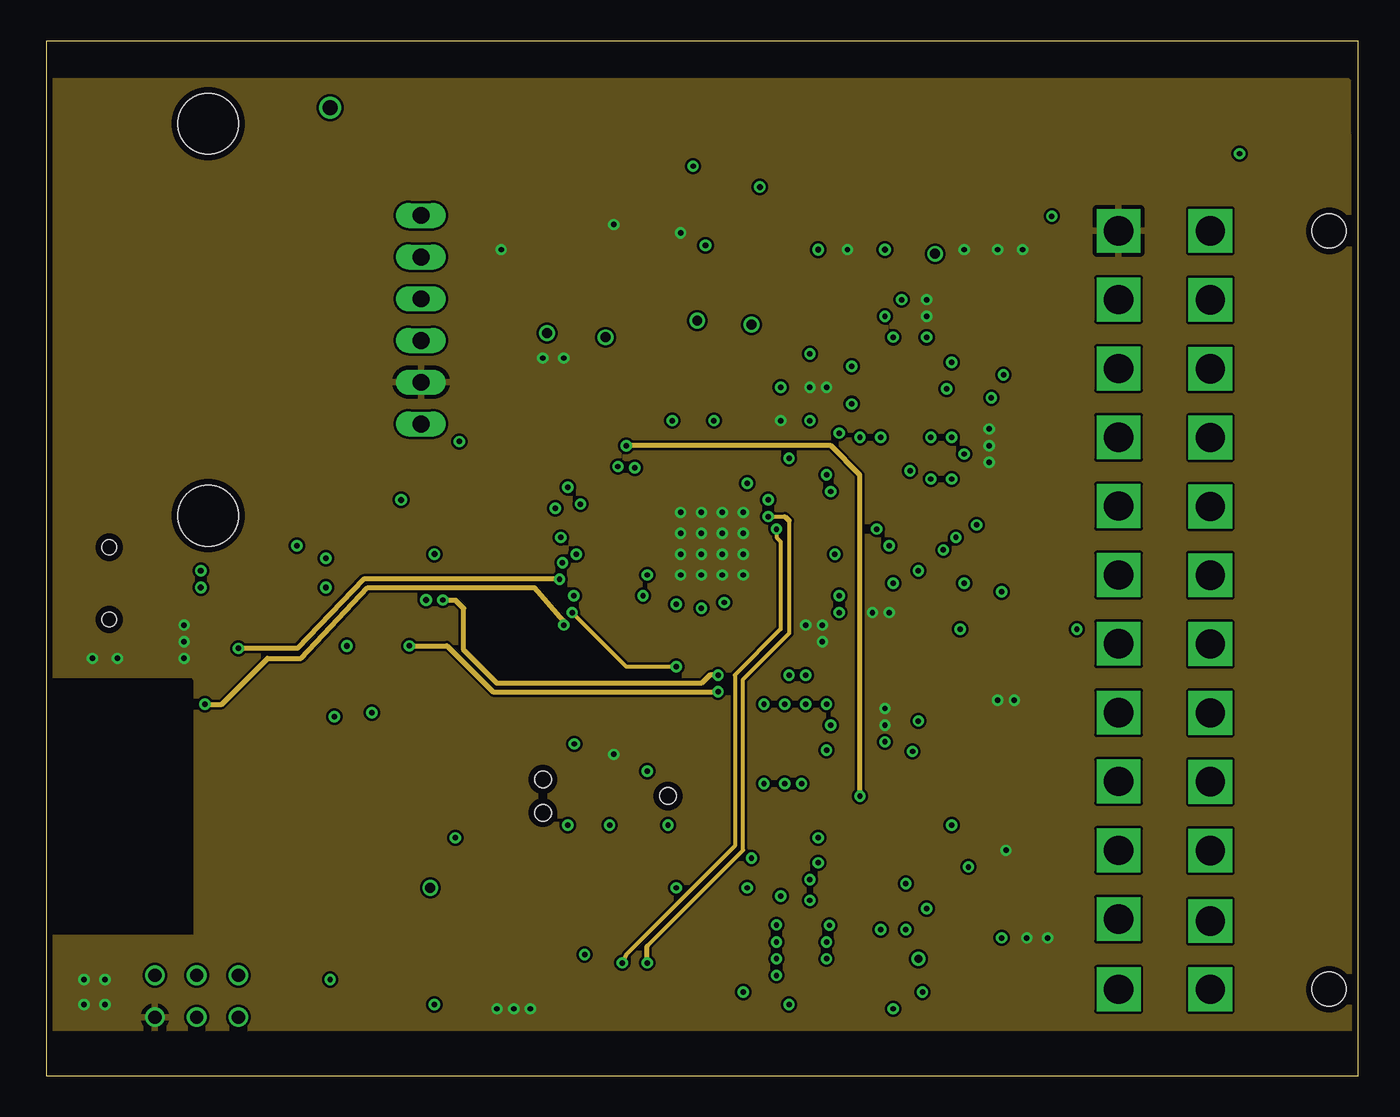
[diagram p7: board, inner layer Route2]
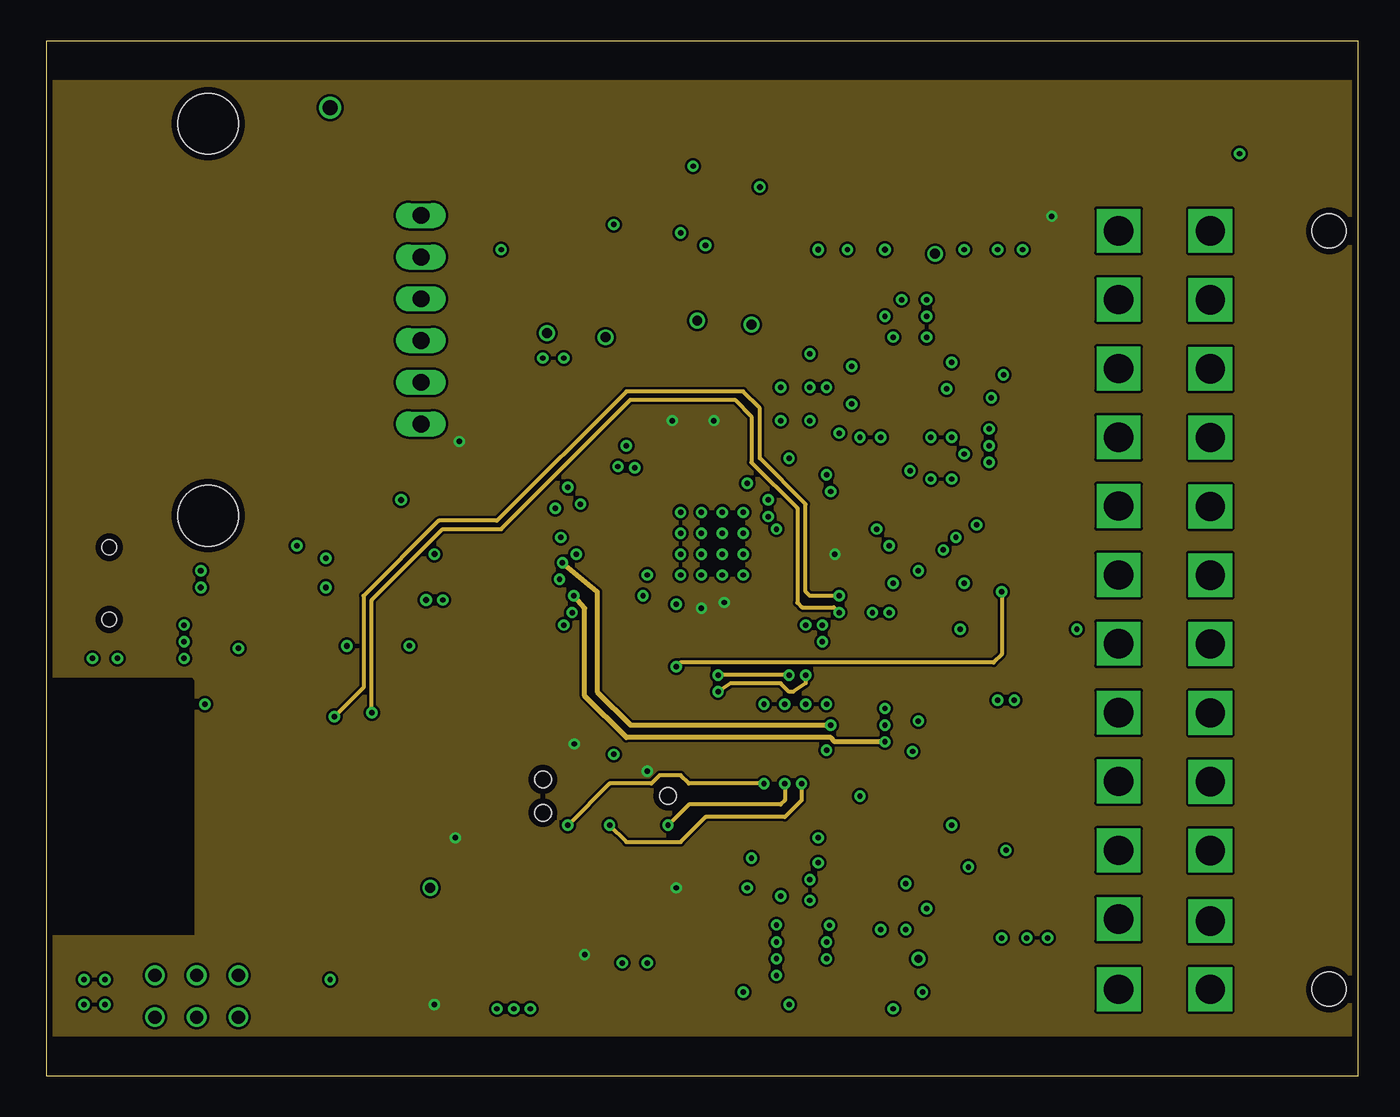
[diagram p8: board, inner layer Route15]
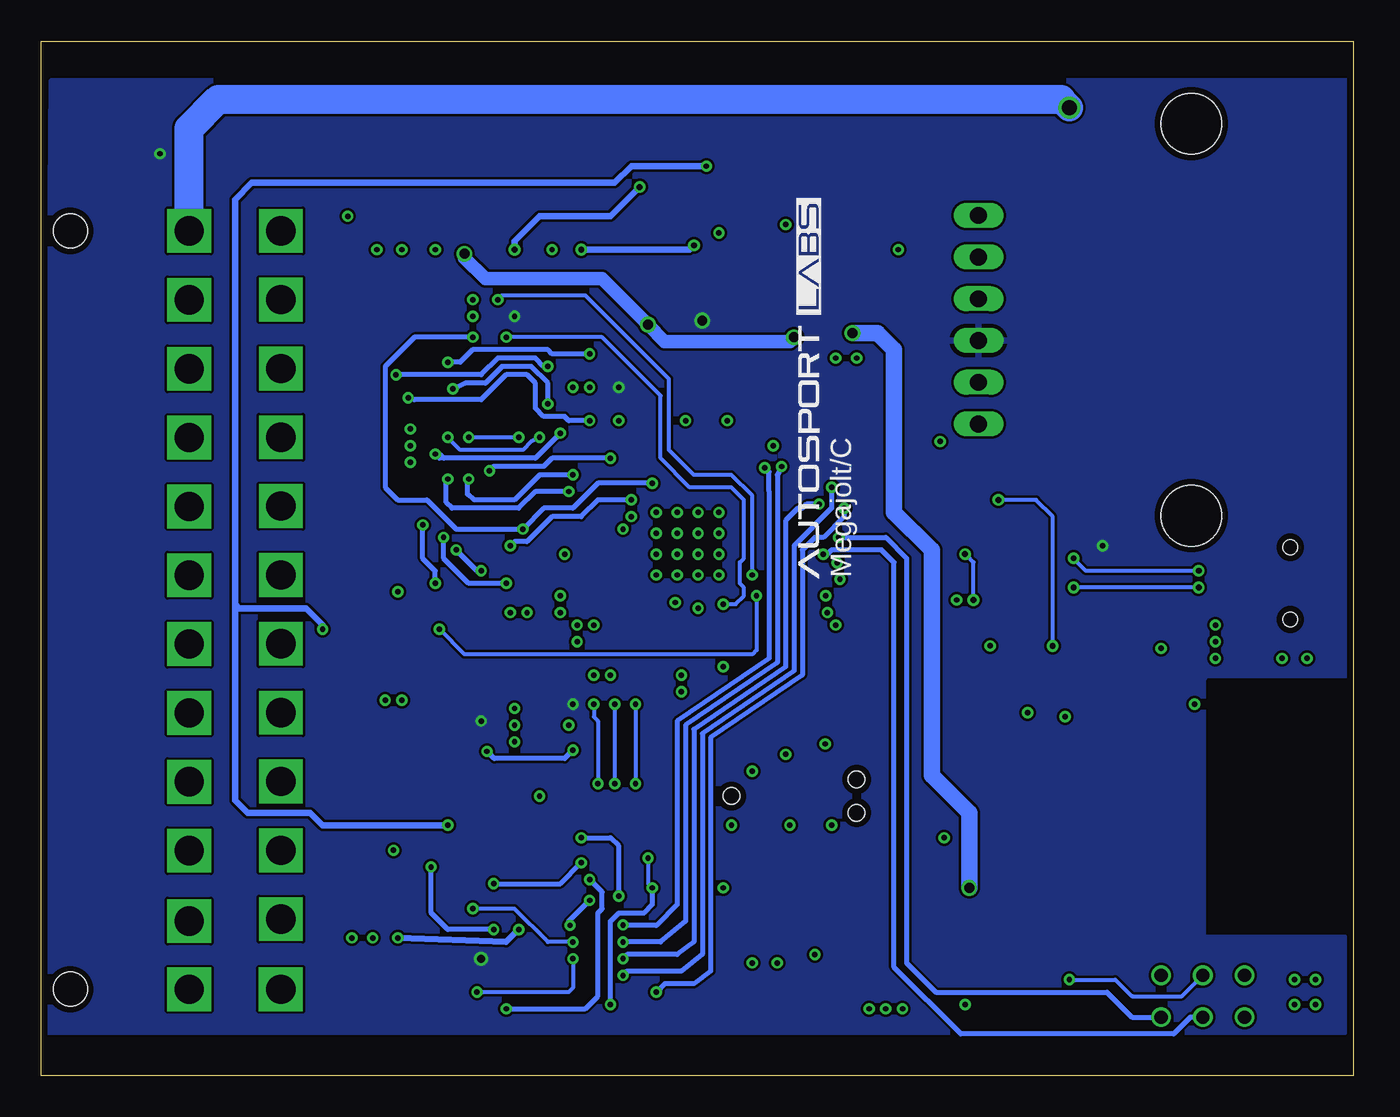
[diagram p9: board, bottom side, seen from below]

Size 79.88 x 62.99 mm. Coordinates in mm from the lower left corner, seen from the top.
Outline: 0,0 79.88,0 79.88,62.99 0,62.99 0,0
Copper layers (1+2*15+16): Top 0.0356mm / dielectric 1.5011mm / Route2 0.0356mm / dielectric 0.1499mm / Route15 0.0356mm / dielectric 0.2007mm / Bottom 0.0356mm
Design rules "LaenPCBOrder *": minimum track width 5mil, minimum drill 13mil, track to track 6mil, track to pad 6mil, pad to pad 6mil, via to via 6mil, smd to smd 6mil, copper to edge 15mil, drill to drill 6mil, minimum pad ring 7mil, minimum via ring 7mil, stop-mask expansion 3mil, vias tented up to drill 0mil, thermal gap 10mil

### Footprints (pad centres in the part's own frame; a part is rotated, then mirrored left to right if it is on the bottom)
SMC_A = smd 1.6 x 1.4: + -1.5,0; - 1.5,0
C0603 = smd 1.1 x 1: 1 -0.85,0; 2 0.85,0
C0603K = smd 1.05 x 1.08: 1 -0.875,0; 2 0.875,0
0603 = smd 1.1 x 1: 1 -0.85,0; 2 0.85,0
SMC_D = smd 2.4 x 2.8: + -3.15,0; - 3.15,0
153CLV-0605 = smd 3.5 x 1.6: + 2.7,0; - -2.7,0
1206_ARRAY = smd 0.34 x 0.7: 1 -1.2,-0.85; 2 -0.4,-0.85; 3 0.4,-0.85; 4 1.2,-0.85; 5 1.2,0.85; 6 0.4,0.85; 7 -0.4,0.85; 8 -1.2,0.85
SMA = smd 1.8 x 1.7: A 2.05,0; C -2.05,0
SOT23 = smd 1 x 1.4: 1 -0.95,-1.1; 2 0.95,-1.1; 3 0,1.1
SMC = smd 2.8 x 3.8: A 3.7,0; C -3.7,0
SSOP-16-FTDI = smd 0.32 x 1.26: 1 -2.223,-2.779; 2 -1.588,-2.779; 3 -0.953,-2.779; 4 -0.318,-2.779; 5 0.317,-2.779; 6 0.952,-2.779; 7 1.587,-2.779; 8 2.222,-2.779; 9 2.222,2.779; 10 1.587,2.779; 11 0.952,2.779; 12 0.317,2.779; 13 -0.318,2.779; 14 -0.953,2.779; 15 -1.588,2.779; 16 -2.223,2.779
SOT223 = smd 1.219 x 2.235: 1 -2.311,-3.099; 2 0,-3.099; 3 2.311,-3.099 | smd 3.6 x 2.2: 4 0,3.099
JUMPER_CLOSED_THICK = smd 1.168 x 1.6: 1 -0.762,0; 2 0.762,0
1210 = smd 1.6 x 2.7: 1 -1.4,0; 2 1.4,0
1812 = smd 1.6 x 3: 1 -2.3,0; 2 2.3,0
CD54 = smd 6 x 2.4: P$1 0,1.85; P$2 0,-1.85
MPX4250 = drill 1.016 long: GND 3.81,0; NC1 -1.27,0; NC2 -3.81,0; NC3 -6.35,0; OUT 6.35,0; PWR 1.27,0 | hole 3.683: -11.938,-12.954; 11.938,-12.954
R0603 = smd 1 x 1.1: 1 -0.85,0; 2 0.85,0
R1206 = smd 1.6 x 1.803: 1 -1.422,0; 2 1.422,0
0603-ARC = smd 0.5 x 0.65: 1 -1.2,-0.625; 2 -0.4,-0.625; 3 0.4,-0.625; 4 1.2,-0.625; 5 1.2,0.625; 6 0.4,0.625; 7 -0.4,0.625; 8 -1.2,0.625
SOT23-EBC = smd 1 x 1.4: B 0.95,-1.1; C 0,1.1; E -0.95,-1.1
TC2050-IDC-NL = smd 0.787 x 0.787: 1 -2.54,-0.635; 2 -2.54,0.635; 3 -1.27,-0.635; 4 -1.27,0.635; 5 0,-0.635; 6 0,0.635; 7 1.27,-0.635; 8 1.27,0.635; 9 2.54,-0.635; 10 2.54,0.635 | hole 0.991: -3.81,0; 3.81,1.016; 3.81,-1.016
SOT-23 = smd 1 x 1.4: 1 -0.95,-1.1; 2 0.95,-1.1; 3 0,1.1
SOT-23' = smd 0.8 x 0.9: 1 -0.95,-1; 2 0.95,-1; 3 0,1
SO-8 = smd 1.524 x 0.61: 1 -2.743,1.905; 2 -2.743,0.635; 3 -2.743,-0.635; 4 -2.743,-1.905; 5 2.743,-1.905; 6 2.743,-0.635; 7 2.743,0.635; 8 2.743,1.905
SO14 = smd 0.66 x 2.032: 1 -3.81,-3.073; 2 -2.54,-3.073; 3 -1.27,-3.073; 4 0,-3.073; 5 1.27,-3.073; 6 2.54,-3.073; 7 3.81,-3.073; 8 3.81,3.073; 9 2.54,3.073; 10 1.27,3.073; 11 0,3.073; 12 -1.27,3.073; 13 -2.54,3.073; 14 -3.81,3.073
SC-74 = smd 0.5 x 0.5: 1 -0.95,-1.2; 2 0,-1.2; 3 0.95,-1.2; 4 0.95,1.2; 5 0,1.2; 6 -0.95,1.2
SO08 = smd 0.66 x 2.032: 1 -1.905,-3.073; 2 -0.635,-3.073; 3 0.635,-3.073; 4 1.905,-3.073; 5 1.905,3.073; 6 0.635,3.073; 7 -0.635,3.073; 8 -1.905,3.073
MOLEX_MINIFIT-JR-24 = drill 1.778 pad 2.54 square: P1 -20.955,-7.874; P2 -16.764,-7.874; P3 -12.573,-7.874; P4 -8.382,-7.874; P5 -4.191,-7.874; P6 0,-7.874; P7 4.191,-7.874; P8 8.382,-7.874; P9 12.573,-7.874; P10 16.764,-7.874; P11 20.955,-7.874; P12 25.226,-7.866; P13 25.226,-2.286; P14 21.073,-2.286; P15 16.782,-2.286; P16 12.591,-2.286; P17 8.4,-2.286; P18 4.209,-2.286; P19 0.018,-2.286; P20 -4.173,-2.286; P21 -8.364,-2.286; P22 -12.555,-2.286; P23 -16.755,-2.286; P24 -20.955,-2.286 | hole 2.057: -20.955,4.953; 25.226,4.953
ESP8266-ESP12 = smd 2 x 1.2: 1 16.2,2; 2 16.2,4; 3 16.2,6; 4 16.2,8; 5 16.2,10; 6 16.2,12; 7 16.2,14; 8 16.2,16; 9 0,16; 10 0,14; 11 0,12; 12 0,10; 13 0,8; 14 0,6; 15 0,4; 16 0,2
TSSOP-20 = smd 0.35 x 1.43: 1 -2.925,-2.7; 2 -2.275,-2.7; 3 -1.625,-2.7; 4 -0.975,-2.7; 5 -0.325,-2.7; 6 0.325,-2.7; 7 0.975,-2.7; 8 1.625,-2.7; 9 2.275,-2.7; 10 2.925,-2.7; 11 2.925,2.7; 12 2.275,2.7; 13 1.625,2.7; 14 0.975,2.7; 15 0.325,2.7; 16 -0.325,2.7; 17 -0.975,2.7; 18 -1.625,2.7; 19 -2.275,2.7; 20 -2.925,2.7
QSOP16 = smd 0.45 x 1.5: 1 -2.223,-2.69; 2 -1.587,-2.69; 3 -0.953,-2.69; 4 -0.318,-2.69; 5 0.318,-2.69; 6 0.953,-2.69; 7 1.587,-2.69; 8 2.223,-2.69; 9 2.223,2.69; 10 1.587,2.69; 11 0.953,2.69; 12 0.318,2.69; 13 -0.318,2.69; 14 -0.953,2.69; 15 -1.587,2.69; 16 -2.223,2.69
RIGHT_ANGLE_3_LEDS_DEEP = drill 0.8: 1 -1.27,0; 2 1.27,0; 3 -1.27,2.54; 4 1.27,2.54; 5 -1.27,5.08; 6 1.27,5.08
SOIC127P600X175-8N = smd 1.981 x 0.559: 1 -2.362,1.905; 2 -2.362,0.635; 3 -2.362,-0.635; 4 -2.362,-1.905; 5 2.362,-1.905; 6 2.362,-0.635; 7 2.362,0.635; 8 2.362,1.905
INF-PG-LQFP-64-5800X5800T28 = smd 2.05 x 0.3: 1 -5.625,3.75; 2 -5.625,3.25; 3 -5.625,2.75; 4 -5.625,2.25; 5 -5.625,1.75; 6 -5.625,1.25; 7 -5.625,0.75; 8 -5.625,0.25; 9 -5.625,-0.25; 10 -5.625,-0.75; 11 -5.625,-1.25; 12 -5.625,-1.75; 13 -5.625,-2.25; 14 -5.625,-2.75; 15 -5.625,-3.25; 16 -5.625,-3.75; 33 5.625,-3.75; 34 5.625,-3.25; 35 5.625,-2.75; 36 5.625,-2.25; 37 5.625,-1.75; 38 5.625,-1.25; 39 5.625,-0.75; 40 5.625,-0.25; 41 5.625,0.25; 42 5.625,0.75; 43 5.625,1.25; 44 5.625,1.75; 45 5.625,2.25; 46 5.625,2.75; 47 5.625,3.25; 48 5.625,3.75 | smd 0.3 x 2.05: 17 -3.75,-5.625; 18 -3.25,-5.625; 19 -2.75,-5.625; 20 -2.25,-5.625; 21 -1.75,-5.625; 22 -1.25,-5.625; 23 -0.75,-5.625; 24 -0.25,-5.625; 25 0.25,-5.625; 26 0.75,-5.625; 27 1.25,-5.625; 28 1.75,-5.625; 29 2.25,-5.625; 30 2.75,-5.625; 31 3.25,-5.625; 32 3.75,-5.625; 49 3.75,5.625; 50 3.25,5.625; 51 2.75,5.625; 52 2.25,5.625; 53 1.75,5.625; 54 1.25,5.625; 55 0.75,5.625; 56 0.25,5.625; 57 -0.25,5.625; 58 -0.75,5.625; 59 -1.25,5.625; 60 -1.75,5.625; 61 -2.25,5.625; 62 -2.75,5.625; 63 -3.25,5.625; 64 -3.75,5.625 | smd 5.8 x 5.8: 65 0,0
MINI-USB_JACK = smd 2.25 x 0.5: 1 3.52,1.6; 2 3.52,0.8; 3 3.52,0; 4 3.52,-0.8; 5 3.52,-1.6 | smd 2.5 x 2: M1 -2,-4.2; M2 -2,4.2; M3 3.45,4.2; M4 3.45,-4.2 | hole 0.9: 0.9,-2.2; 0.9,2.2
CRYSTAL-SMD-5X3 = smd 1.9 x 1.1: 1 -1.85,-1.15; 2 1.85,-1.15; 3 1.85,1.15; 4 -1.85,1.15

### Placement (x,y rotation side)
C1  28.45,46.48 270 top
C2  37.08,45.47 270 top
C3  19.3,33.78 0 top
C4  19.3,27.69 0 top
C5  28.19,35.05 0 top
C6  29.46,25.91 180 top
C7  25.15,37.08 0 top
C8  22.1,37.08 180 top
C9  25.15,35.05 0 top
C10  27.43,12.19 0 top
C11  20.07,47.24 90 top
C12  29.46,21.84 180 top
C13  40.89,13.97 0 top
C14  13.34,28.07 0 top
C15  32.77,21.84 0 top
C16  29.46,27.94 180 top
C17  32.77,23.88 0 top
C18  32.77,25.91 0 top
C19  29.46,23.88 180 top
C20  61.21,52.32 270 top
C21  47.24,46.48 90 top
C22  50.8,25.15 90 top
C23  35.81,49.78 180 top
C24  45.72,46.99 270 top
C25  35.81,20.57 270 top
C26  43.94,20.57 90 top
C28  32.51,12.19 90 top
C30  52.83,25.15 90 top
C31  48.77,25.15 90 top
C32  57.91,15.75 270 top
C36  29.21,37.34 180 top
C37  47.04,52.53 270 top
C38  44.32,59.54 0 top
C39  57.2,55.65 270 top
C40  41.71,58.62 270 top
C41  37.13,55.47 90 top
C42  20.07,43.94 270 top
C43  57.91,19.56 270 top
C45  52.07,13.46 0 top
CN2  44.7,11.94 270 top
D1  13.21,30.48 180 top
D2  77.72,57.4 90 top
D4  58.17,46.99 180 top
D6  24.89,57.15 90 top
D7  30.48,54.86 270 top
D17  47.12,57.12 90 top
IC1  24.13,30.23 0 top
IC2  32.77,44.45 180 top
IC3  41.4,44.96 180 top
J3  41.15,16.76 180 top
L1  74.93,57.91 90 top
L2  21.08,56.95 270 top
L3  51.61,56.49 270 top
PS1  22.81,46.02 270 top
R1  19.3,31.75 0 top
R2  59.69,12.19 0 top
R3  19.3,29.72 0 top
R4  9.91,27.43 90 top
R5  16.76,27.43 270 top
R6  27.43,10.16 0 top
R7  60.96,47.75 270 top
R8  29.21,41.4 0 top
R9  27.43,14.22 0 top
R10  27.43,16.26 0 top
R11  60.45,44.96 0 top
R12  59.69,4.32 0 top
R14  46.23,20.57 90 top
R15  60.45,16.76 0 top
R16  59.69,9.91 0 top
R17  60.45,14.73 0 top
R18  60.45,20.83 0 top
R19  59.69,6.6 0 top
R21  36.58,12.19 90 top
R23  60.45,18.8 0 top
R24  34.54,12.19 90 top
R26  44.32,57.91 0 top
R27  53.34,52.07 180 top
R28  50.29,52.07 180 top
R29  60.45,42.93 0 top
R30  60.45,40.89 0 top
R31  27.43,8.13 0 top
R32  29.21,39.37 0 top
R35  54.86,25.15 270 top
R36  60.96,24.51 90 top
R37  52.07,15.49 180 top
R38  49.53,14.48 90 top
R39  27.43,18.29 180 top
R40  15.49,5.08 90 top
R41  18.8,5.08 90 top
R42  22.1,5.08 90 top
R43  60.45,38.86 0 top
R44  60.45,36.83 0 top
R45  60.45,34.8 0 top
R46  60.45,32.77 0 top
R47  60.45,30.73 0 top
RN1  45.97,7.62 270 top
RN2  42.67,7.62 270 top
T1  57.91,25.15 270 top
TC2  34.04,17.02 180 top
U1  60.96,57.15 0 top
U4  ZXMS6004FF  [SOT-23']  57.91,28.47 270 top
U8  43.21,53.21 90 top
U11  52.32,7.62 90 top
U12  44.7,15.24 270 top
U18  52.32,46.74 270 top
U$1  73.15,30.48 270 top
U$2  25.68,8.23 90 top
U$3  47.24,41.91 0 top
U$4  53.59,37.59 0 top
U$5  52.07,20.57 270 top
U$6  6.6,4.83 270 top
U$7  53.85,28.7 180 top
U$8  34.54,6.86 90 top
U$9  40.39,32.26 270 top
X1  2.92,29.97 0 top
XTAL1  39.88,20.57 180 top

### Tracks (layer width: path | path; a pad name or v marks a point on that pad's centre or on a via)
+3V3  (via drill 0.33, 0.33 pad 0.36)
  Top 0.254: IC1.12 24.45,34.65 C9.1 | U$9.42 41.14,28.44 v41.27,28.8
  Top 0.305: C9.1 C7.1 C8.1 | U$9.56 47.75,32.01 v48.01,31.75 | v40.64,39.88 v40.64,39.87 U$9.8 U$9.9 | U$9.13 38.14,39.84 v38.1,39.88 | C15.1 31.92,20.41 v32.13,20.19 32.26,20.07 | C15.1 C12.1 | C15.1 C17.1 | C17.1 C19.1 | C17.1 C18.1 C6.1 C16.1 30.48,28.11 30.48,32.77 30.97,33.51 U$9.22 | R21.2 R24.2 34.38,13.04 33.53,12.19 33.53,11.68 33.27,11.43 32.6,11.43 C28.1 | U$8.8 32.64,7.49 v32.77,7.37 | TC2.1 v36.58,18.54 | IC1.12 24.45,34.99 24.38,35.05 | R9.1 25.65,14.22 25.4,14.48 v24.89,14.48 | U$9.38 39.14,27.71 v39.88,28.45 | C13.1 40.04,13.12 v38.35,11.43
  Top 0.356: R40.1 R41.1 R42.1 23.53,4.23 v23.62,4.32
  Top 0.406: C7.1 24.3,37.76 v25.15,38.61
  Top 0.61: U$8.8 32.64,11.21 C28.1 | U1.2 61.91,54.52 C20.+ v61.21,52.32
  Bottom 0.305: 32.26,20.07 v32.13,20.19
  pour Route15: 0.25,60.45 0.25,24.38 8.89,24.38 9.14,24.13 9.14,8.38 0.25,8.38 0.25,2.54 79.5,2.54 79.5,60.45
+5V  (via drill 0.33, 0.5, 0.6)
  Top 0.254: U$5.14 53.15,21.53 v53.09,21.59 53.09,24.04 C30.1 C22.1 C31.1 | PS1.PWR 23.08,44.76 C42.1 C11.1
  Top 0.305: R14.2 47.24,22.1 v47.5,22.61
  Top 0.406: U$4.20 50.67,42.8 52.58,44.7 52.58,45.97 52.32,46.23 v51.05,46.23
  Top 0.61: D1.C 15.26,32.24 v15.24,32.26 | C21.1 47.74,46.1 U18.3 50.93,46.1 v51.05,46.23 | L1.1 73.02,56.51 v72.64,56.13
  Top 0.813: U11.4 53.59,7.62 v53.09,7.11 | C23.+ 38.61,49.78 39.09,49.3 IC3.3 39.09,46.51 v39.62,45.97 40.39,45.97 42.42,43.94 43.69,43.94 44.7,42.93 v44.7,41.91
  pour Bottom: 0,60.55 0.25,24.38 8.89,24.38 9.14,24.13 9.14,8.38 0.51,8.38 0.51,2.67 79.76,2.67 79.25,60.55
AGND  (via drill 0.33)
  Top 0.254: CN2.2 44.05,12.34 44.7,11.68 45.41,11.68 CN2.6
  Top 0.305: U$9.21 31.52,34.01 v30.99,34.54
  Bottom 0.305: v30.99,34.54 30.99,34.04 32.26,32.77 32.77,32.77 33.53,32 33.53,24.38 39.12,20.57 39.12,6.35 40.13,5.59 41.91,5.59 v42.42,5.08
  pour Top: 41.4,2.54 41.4,17.53 56.9,17.53 56.9,2.54
ANALOG-FREQ_1_OPAMP_OUT1  (via drill 0.33, 0.33 pad 0.18)
  Top 0.254: RN1.6 47.39,7.22 v47.5,7.11 | v53.34,5.08 U11.2
  Top 0.305: U11.2 U11.1
  Bottom 0.254: v47.5,7.11 47.5,5.33 47.75,5.08 v53.34,5.08
ANALOG-FREQ_1_OPAMP_OUT2  (via drill 0.33)
  Top 0.254: RN1.7 47.39,8.02 v47.5,8.13 | v53.59,10.16 U11.6
  Top 0.305: U11.7 U11.6
  Bottom 0.254: v47.5,8.13 49.02,8.13 51.05,10.16 v53.59,10.16
ANALOG-FREQ_1_OPAMP_OUT3
  Top 0.254: RN1.8 46.6,9.01 47.75,10.16 U11.9
  Top 0.305: U11.8 U11.9
AUX_ADC  (via drill 0.33)
  Top 0.254: RN1.4 44.77,6.42 v44.45,6.1 43.62,6.1 RN2.5 | U$9.19 33.32,35.01 32.77,35.56 32,35.56 v31.75,35.81
  Bottom 0.305: v31.75,35.81 31.75,34.54 34.04,32.26 34.04,24.64 39.62,20.83 39.62,7.37 40.89,6.35 44.2,6.35 v44.45,6.1
AUX_IN
  Top 0.406: R2.2 62.74,11.94 63.25,11.68 68.84,11.68 U$1.P14
CAM_TIM_IN  (via drill 0.33)
  Top 0.305: U$5.5 50.99,20.26 v51.05,20.32 | U$9.30 32.56,29.51 v32.11,29.21
  Route15 0.305: v51.05,20.32 48.01,20.32 47.75,20.57 35.31,20.57 32.77,23.11 32.77,28.45 v32.11,29.21
CAM_VRS+
  Top 0.406: R17.2 62.48,14.73 63.5,15.75 68.72,15.75 U$1.P16
CAM_VRS-
  Top 0.406: R15.2 64.14,16.76 U$1.P9
CAN_RX  (via drill 0.33)
  Top 0.254: U$9.36 38.14,28.67 v38.35,28.7 | v51.56,44.96 49.38,44.96 U18.4
  Bottom 0.254: v38.35,28.7 37.59,28.7 37.08,29.21 37.08,29.72 37.34,29.97 37.34,31.24 37.08,31.5 37.08,35.05 37.85,35.81 40.39,35.81 42.16,37.59 42.16,41.4 45.72,44.96 v51.56,44.96
CAN_TX  (via drill 0.33)
  Top 0.254: U$9.35 37.64,28.4 37.08,28.96 37.08,29.97 v36.58,30.48 | v52.07,47.24 52.07,48.51 51.82,48.77 49.38,48.77 U18.1
  Bottom 0.254: v36.58,30.48 36.58,35.31 37.85,36.58 40.13,36.58 41.66,38.1 41.66,42.42 46.74,47.5 51.82,47.5 v52.07,47.24
CANH
  Top 0.406: U18.7 56.5,47.37 D4.2 57.22,48.58 58.17,49.53 60.03,49.53 R7.1 62.83,48.6 63.5,49.28 68.83,49.28 U$1.P23
CANL
  Top 0.406: U18.6 56.26,46.1 56.52,46.1 56.64,46.23 57.15,46.99 58.02,46.99 D4.1 59.77,48.09 R7.2 64.94,46.9 U$1.P2
CLT_ADC  (via drill 0.33)
  Top 0.254: RN1.3 44.56,7.22 v44.45,7.11 43.41,7.11 RN2.6
  Top 0.305: U$9.20 33.31,34.51 33.27,34.54 32.8,34.76 v32.51,34.8
  Bottom 0.305: v32.51,34.8 33.27,34.8 33.53,34.54 33.78,34.54 34.54,33.78 34.54,24.89 40.13,21.08 40.13,8.13 41.15,7.37 44.2,7.37 v44.45,7.11
CLT_IN
  Top 0.406: R12.2 64.35,4.32 U$1.P12
COIL1
  Top 0.406: R11.2 68.94,44.96 U$1.P22
COIL2
  Top 0.406: R29.2 65.15,42.93 U$1.P3
COIL3
  Top 0.406: R30.2 68.82,40.89 U$1.P21
COIL4
  Top 0.406: R43.2 U$1.P4
COIL5
  Top 0.406: R44.2 68.94,36.83 U$1.P20
COIL6
  Top 0.406: R45.2 65.15,34.8 U$1.P5
COIL7
  Top 0.406: R46.2 63.25,32.77 63.75,32.51 69.07,32.51 U$1.P19
COIL8
  Top 0.406: R47.2 65.02,30.73 U$1.P6
CRANK_TIM_IN  (via drill 0.33)
  Top 0.305: v47.75,21.34 48.01,21.34 48.51,20.83 49.32,20.83 U$5.4 | U$9.28 32.13,30.51 v31.42,31.22
  Route15 0.305: v31.42,31.22 33.53,29.46 33.53,23.37 35.56,21.34 v47.75,21.34
CRANK_VRS+
  Top 0.406: R18.2 61.3,21.68 63.5,24.13 69.07,24.13 U$1.P17
CRANK_VRS-
  Top 0.406: R23.2 61.98,18.8 U$1.P8
EEPROM_SCL  (via drill 0.33)
  Top 0.254: U$8.6 35.18,10.71 R24.1
  Top 0.305: U$9.59 44.68,33.51 v44.45,33.27 | v35.05,6.86 35.05,9.09 U$8.6
  Route2 0.254: v44.45,33.27 44.45,32.77 44.7,32.51 44.7,27.18 41.91,24.38 41.91,13.97 35.31,7.37 v35.05,6.86
EEPROM_SDA  (via drill 0.33)
  Top 0.254: U$8.5 36.45,11.21 R21.1
  Top 0.305: U$9.62 44.91,35.01 v43.94,34.04 | R21.1 v36.58,6.86
  Route2 0.254: 36.58,7.87 42.42,13.72 42.42,24.13 45.21,26.92 45.21,33.78 | v43.94,34.04 44.96,34.04
  Route2 0.305: v36.58,6.86 36.58,7.87 | 44.96,34.04 45.21,33.78
ESP_GPIO0  (via drill 0.33)
  Top 0.254: U$9.50 48.06,29.01 v48.26,29.21 | v17.53,21.84 17.53,24.28 U$2.4
  Route15 0.254: v48.26,29.21 46.48,29.21 46.23,29.46 46.23,34.8 43.43,37.59 43.43,40.64 42.42,41.66 35.31,41.66 27.43,33.78 23.88,33.78 19.3,29.21 19.3,23.62 v17.53,21.84
ESP_GPIO2  (via drill 0.33)
  Top 0.254: U$2.3 19.68,22.23 v19.81,22.1 | U$9.49 47.95,28.51 v48.26,28.19
  Route15 0.254: v19.81,22.1 19.81,28.96 24.13,33.27 27.69,33.27 35.56,41.15 41.91,41.15 42.93,40.13 42.93,37.34 45.72,34.54 45.72,28.8 U$9.49 47.95,28.51 48.01,28.45 v48.26,28.19
ESP_RXD  (via drill 0.33)
  Top 0.305: U$9.29 31.46,30.01 v31.24,30.23 | v11.68,26.01 U$2.7
  Route2 0.305: v31.24,30.23 19.3,30.23 15.27,26.01 v11.68,26.01
ESP_TXD  (via drill 0.33)
  Top 0.305: U$2.8 9.68,22.63 v9.65,22.61 | U$9.32 34.7,28.45 34.7,27.84 34.29,27.43 v31.5,27.43
  Route2 0.305: v9.65,22.61 10.67,22.61 13.46,25.4 15.49,25.4 19.56,29.72 29.72,29.72 31.5,27.69 v31.5,27.43
FTDI_DM  (via drill 0.36)
  Top 0.254: C3.1 R1.1 18.2,31.5 v17.02,31.5 | X1.2 9.36,30.77 v9.4,30.73
  Bottom 0.254: v9.4,30.73 16.26,30.73 v17.02,31.5
FTDI_DP  (via drill 0.36)
  Top 0.254: C4.1 R3.1 v17.02,29.72 | X1.3 9.14,29.97 v9.4,29.72
  Bottom 0.254: v9.4,29.72 v17.02,29.72
FTDI_RXD  (via drill 0.33)
  Top 0.254: U$9.47 43.64,24.94 44.2,24.38 v45.21,24.38
  Top 0.305: IC1.4 23.81,28.64 v24.13,28.96
  Route2 0.305: v40.89,24.38 40.39,24.38 39.88,23.88 27.43,23.88 25.4,25.91 25.4,28.45 24.89,28.96 v24.13,28.96
  Route15 0.254: v45.21,24.38 v40.89,24.38
FTDI_TXD  (via drill 0.33)
  Top 0.254: U$9.48 45.5,26.63 46.23,26.16 v46.23,24.38
  Top 0.305: IC1.1 21.91,26.35 v22.1,26.16 | 44.2,26.57 U$9.48
  Route2 0.305: v22.1,26.16 24.38,26.16 27.18,23.37 v40.89,23.37
  Route15 0.254: v46.23,24.38 46.23,23.88 45.47,23.37 45.21,23.37 44.7,23.88 41.66,23.88 v40.89,23.37
FTDI_VBUS_SENSE  (via drill 0.36)
  Top 0.254: R5.2 17.87,26.58 v18.29,26.16 | IC1.15 22.54,34.1 v21.59,35.05
  Top 0.305: R4.1 11.09,26.58 11.18,26.67 16.68,26.67 R5.2
  Bottom 0.254: v18.29,26.16 18.29,34.04 19.3,35.05 v21.59,35.05
GND  (via drill 0.33)
  Top 0.254: U$9.37 38.64,27.71 38.63,28.04 38.86,28.19 39.12,28.45 39.12,30.99 v39.88,31.75 U$9.65 40.64,32.01 U$9.41
  Top 0.305: TC2.3 35.31,18.03 34.54,18.8 v34.54,19.56 | C14.- 16.55,28.07 R5.1
  Top 0.406: 43.26,59.47 C38.1 | 41.91,59.69 41.66,59.44
  other vias: 57.4,37.34 57.4,38.35 57.4,39.37 51.05,21.34 51.05,22.35 27.43,4.06 28.45,4.06 29.46,4.06 38.61,30.48 38.61,31.75 38.61,33.02 38.61,34.29 39.88,34.29 39.88,33.02 39.88,30.48 42.42,30.48 41.15,30.48 41.15,31.75 42.42,31.75 42.42,33.02 42.42,34.29 41.15,34.29 41.15,33.02 57.91,22.86 58.93,22.86 50.29,28.19 51.31,28.19 46.48,41.91 47.5,41.91 31.5,43.69 30.23,43.69 2.29,5.84 3.56,5.84 3.56,4.32 2.29,4.32 46.23,27.43 47.24,27.43 47.24,26.42 44.7,39.88 53.59,47.24 53.59,46.23 48.77,50.29 55.88,50.29 59.44,50.29 57.91,50.29 34.54,51.82 38.61,51.31 27.69,50.29 59.69,8.38 60.96,8.38 58.42,13.72 2.79,25.4 4.32,25.4 8.38,25.4 8.38,26.42 8.38,27.43
  pour Top (rank 6): 0.25,60.55 0,24.38 8.89,24.38 9.14,24.13 9.14,8.38 0.51,8.38 0.51,2.79 40.89,2.54 40.89,18.29 41.15,18.29 41.15,18.03 57.4,18.03 57.4,2.54 62.48,2.54 79.63,2.67 79.63,7.62 79.76,7.62 79.38,60.55
  pour Route2: 0,60.55 0,24.38 8.89,24.38 9.14,24.13 9.14,8.38 0.25,8.38 0.25,2.92 79.5,2.92 79.25,60.55
GPO_COIL1  (via drill 0.33)
  Top 0.305: U$9.2 43.64,35.61 v43.94,35.05 | v51.31,32.26 51.31,34.88 U$4.2
  Bottom 0.305: v43.94,35.05 45.97,35.05 46.99,34.04 48.77,34.04 50.29,32.51 51.05,32.51 v51.31,32.26
GPO_COIL2  (via drill 0.33)
  Top 0.305: U$4.4 52.62,36.79 v52.58,36.83 | U$9.1 44.41,37.88 v45.21,37.59
  Bottom 0.305: v45.21,37.59 48.77,37.59 49.28,37.08 52.32,37.08 v52.58,36.83
GPO_COIL3  (via drill 0.33)
  Top 0.305: U$9.64 46.93,36.01 v47.5,36.58 | v53.85,36.32 53.85,34.96 U$4.6
  Bottom 0.305: v47.5,36.58 49.53,36.58 51.05,35.05 53.51,35.05 53.92,35.4 53.92,36.25 v53.85,36.32
GPO_COIL4  (via drill 0.33)
  Top 0.305: U$9.63 47.7,35.51 v47.75,35.56 | v55.12,36.32 55.12,34.99 U$4.8
  Bottom 0.305: v47.75,35.56 49.78,35.56 50.8,34.54 54.87,34.54 U$4.8 55.22,36.22 v55.12,36.32
GPO_COIL5  (via drill 0.33)
  Top 0.305: U$9.61 48.22,34.51 48.51,34.8 48.51,38.86 v48.26,39.12 | U$4.11 56.52,38.48 v55.88,37.85
  Bottom 0.305: v48.26,39.12 49.78,37.59 55.37,37.59 | 55.37,37.59 55.63,37.59 v55.88,37.85 55.63,37.85 55.37,37.59
GPO_COIL6  (via drill 0.33)
  Top 0.254: v49.53,38.86 49.02,38.1 49.02,34.29 48.74,34.01 U$9.60 | v55.12,38.86 55.12,40.19 U$4.13
  Bottom 0.254: v49.53,38.86 50.04,38.61 50.55,38.1 54.36,38.1 v55.12,38.86
GPO_COIL7  (via drill 0.33)
  Top 0.254: v50.8,38.86 49.53,37.59 49.53,34.04 48.5,33.01 U$9.58 | v53.85,38.86 53.85,40.22 U$4.15
  Bottom 0.254: v50.8,38.86 v53.85,38.86
GPO_COIL8
  Top 0.254: U$4.17 52.58,40.25 52.58,39.12 52.32,38.86 51.82,38.86 50.04,37.08 50.04,33.78 48.77,32.51 U$9.57
GPO_COIL_EN  (via drill 0.33)
  Top 0.305: U$9.4 42.64,36.1 v42.67,36.07 | U$4.1 50.67,33.4 v50.55,33.27 | U$4.19 51.32,42.68 v53.59,44.96
  Bottom 0.305: v42.67,36.07 45.97,36.07 47.5,34.54 49.28,34.54 v50.55,33.27 54.61,33.27 56.39,35.05 58.17,35.05 58.93,35.81 58.93,43.18 57.15,44.96 v53.59,44.96
IAT_ADC  (via drill 0.33)
  Top 0.254: RN2.8 43.87,8.82 v44.45,9.17 45.02,9.14 RN1.1 | U$9.18 36.02,35.51 36.32,35.81 36.32,36.5 v35.81,37.01
  Bottom 0.254: 35.56,36.75 v35.81,37.01
  Bottom 0.305: v44.45,9.17 44.42,9.14 42.42,9.14 41.15,10.41 41.15,21.59 35.56,25.4 35.56,35.56 35.56,36.75
IAT_IN
  Top 0.406: R19.2 61.98,6.35 62.99,7.37 68.75,7.37 U$1.P13
MAP_ADC
  Top 0.305: R32.2 R8.2 | R32.2 C36.1 | U$9.15 37.14,39.32 36.58,39.88 30.57,39.88 R32.2
MAX_DIRN  (via drill 0.33)
  Top 0.254: U$5.12 53.25,20.26 v52.73,19.74 | v47.5,19.81 46.32,19.81 R14.1
  Bottom 0.254: 47.57,19.74 v47.5,19.81
  Bottom 0.305: 47.57,19.74 48.01,19.3 52.3,19.3 v52.73,19.74
N$1
  Top 0.254: R3.2 22.1,29.72 22.35,29.97 25.91,29.97 26.42,29.46 26.42,27.51 IC1.8
N$2
  Top 0.61: L1.2 77.58,59.31 D2.A
N$3
  Top 0.254: R1.2 21.34,31.75 22.35,30.73 25.91,30.73 26.42,31.24 26.42,32.94 IC1.9
N$4  (via drill 0.36)
  Top 0.254: IC1.10 25.72,33.84 25.91,34.04 27.18,34.04 27.34,34.2 C5.1 | IC1.3 23.18,28.89 v23.11,28.96 | IC1.11 25.08,31.94 24.89,31.75 v23.62,31.75
  Top 0.305: IC1.11 IC1.10
  Bottom 0.254: v23.11,28.96 23.11,31.24 23.5,31.62 v23.62,31.75
N$7
  Top 0.305: PS1.OUT 28.05,39.67 R32.1
N$8  (via drill 0.36)
  Top 0.406: R28.1 51.14,50.38 v51.05,50.29 | v43.43,54.1 44.45,54.1 45.21,54.86 45.21,55.85 U8.5
  Top 1.27: R27.2 R28.1
  Bottom 0.406: v51.05,50.29 51.05,50.8 49.53,52.32 45.21,52.32 v43.43,54.1
N$9  (via drill 0.36)
  Top 0.406: C37.2 47.04,50.34 v46.99,50.29 | v40.13,50.55 41.22,50.55 U8.1
  Bottom 0.406: v46.99,50.29 40.39,50.29 v40.13,50.55
N$10
  Top 1.778: L3.P$2 48.35,55.08 D17.C 47.04,55
  pour Top (no thermals): 43.69,49.78 44.2,49.78 44.2,51.56 45.72,52.83 48.51,52.83 49.28,53.34 51.05,53.34 51.05,59.44 48.51,59.44 48.51,56.9 47.75,56.13 46.23,56.13 46.23,54.1 45.72,54.1 44.7,53.59 43.69,52.07
N$11
  Top 0.61: R26.2 C38.2
N$12
  Top 0.61: U8.6 43.84,57.55 R26.1
N$13
  Top 0.61: U8.8 41.3,57.37 C40.2
N$14
  Top 0.254: U11.14 U11.13 48.51,5.08 47.24,6.35 46.67,6.35 RN1.5
N$15
  Top 1.778: L2.1 24.84,59.25 D6.A
N$16
  Top 0.406: T1.B 54.96,24.2 R35.2
N$17
  Top 0.305: U$2.9 9.91,8.46 9.91,12.45 11.43,13.97 23.88,13.97 25.65,12.19 C10.1 R6.1
N$18
  Top 0.305: R31.1 25.4,8.13 24.89,8.64 24.89,11.68 23.62,12.95 15.75,12.95 13.97,11.18 13.97,8.52 U$2.11
N$20
  Top 0.254: R40.2 14.06,5.93 12.95,4.83 7.87,4.83 U$6.1
N$21
  Top 0.254: C26.2 43.9,21.72 XTAL1.1 41.85,21.59 40.64,21.59 40.14,22.09 U$9.40
N$22  (via drill 0.33 pad 0.36)
  Top 0.254: R41.2 17.36,5.93 v17.27,5.84
  Bottom 0.254: v17.27,5.84 14.48,5.84 13.46,4.83 10.41,4.83 U$6.3
N$23
  Top 0.254: R42.2 21.25,5.93 20.32,6.86 12.45,6.86 U$6.5
N$24
  Top 0.406: U$2.2 21.68,20.48 23.88,18.29 R39.2
N$25
  Top 0.254: C25.2 36.37,19.42 XTAL1.3 38.42,19.56 39.37,19.56 39.64,19.82 U$9.39
N$26  (via drill 0.33)
  Top 0.305: R12.1 57.15,4.32 56.9,4.57 56.9,5.84 56.39,6.35 U11.3 52.58,6.35 52.07,5.84 52.07,4.57 v51.56,4.06 | v46.48,11.94 46.48,12.19 45.7,12.19 CN2.7 44.81,12.34 44.7,12.45 44.7,15.75 44.2,16.26 43.57,16.26 U12.1
  Bottom 0.305: v51.56,4.06 46.74,4.06 45.97,4.83 45.97,9.91 45.72,10.16 45.72,11.18 v46.48,11.94
N$27
  Top 0.305: R18.1 58.33,20.83 C43.1 57.91,21.34 56.45,22.8 U$5.16
N$28  (via drill 0.33)
  Top 0.305: U11.5 53.34,8.89 52.58,9.65 52.58,11.43 v52.32,11.68 | v46.99,12.95 46.48,12.95 46.23,13.21 45.62,13.21 CN2.8 45.21,13.48 45.21,16 45.4,16.19 U12.6
  Top 0.406: R16.1 57.66,9.91 56.64,8.89 U11.5
  Bottom 0.305: v52.32,11.68 48.26,11.68 v46.99,12.95
N$29
  Top 0.305: R15.1 59.44,16.6 C32.1 57.82,16.51 56.64,16.51 56.39,16.76 56.39,18.54 55.94,18.99 U$5.10
N$30  (via drill 0.33, 0.33 pad 0.36)
  Top 0.305: U11.10 48.01,8.89 v47.68,9.14 | v46.48,10.67 45.62,10.67 CN2.5 44.89,10.74 v44.7,10.92 | U12.4 46.8,14.29 v46.99,14.48
  Top 0.406: R19.1 58.27,8.28 v58.17,8.38 | v50.8,8.89 U11.10
  Bottom 0.305: v47.68,9.14 47.75,9.4 v46.48,10.67 | v44.7,10.92 44.7,13.97 45.21,14.48 v46.99,14.48
  Bottom 0.406: v58.17,8.38 51.56,8.13 v50.8,8.89
N$31  (via drill 0.33)
  Top 0.254: v42.93,13.23 42.93,13.71 U12.3
  Top 0.305: 51.05,6.35 52.32,7.37 v52.32,8.89 | v56.13,12.7 57.51,12.7 R2.1 | U11.12 51.05,6.35 | 51.05,6.35 51.05,4.57 50.8,4.32 50.8,3.3 50.55,3.05 46.48,3.05 v45.21,4.32 | CN2.3 42.78,11.54 v42.67,11.43
  Bottom 0.254: v42.93,13.23 42.93,11.68 v42.67,11.43
  Bottom 0.305: v52.32,8.89 55.12,8.89 56.13,9.91 v56.13,12.7 | v45.21,4.32 45.21,9.4 44.7,9.91 43.18,9.91 42.67,10.41 v42.67,11.43
N$32
  Top 0.305: R17.1 59.44,14.9 C32.2 57.82,14.99 56.13,14.99 55.88,15.24 55.88,17.27 55.63,17.53 54.86,17.53 54.76,17.63 U$5.9
N$33
  Top 0.305: R23.1 58,18.8 C43.2 57.82,18.8 57.15,18.8 56.64,19.3 56.64,21.84 56.33,22.16 U$5.15
N$36  (via drill 0.33)
  Top 0.305: U$3.6 46.29,43.75 v46.48,43.94
  Top 0.406: U$4.18 51.97,42.32 53.09,43.43 v55.12,43.43 55.37,43.43 57.4,43.43 58.17,44.2 58.84,44.2 R11.1
  Bottom 0.305: v46.48,43.94 48.77,43.94 49.02,44.2 53.59,44.2 54.36,43.43 v55.12,43.43
N$37  (via drill 0.33)
  Top 0.305: U$3.4 48.95,43.11 v49.02,43.18
  Top 0.406: U$4.16 53.27,42.09 53.85,42.67 v58.27,42.67 58.42,42.67 58.67,42.93 R29.1
  Bottom 0.305: v49.02,43.18 49.28,43.18 49.78,43.69 52.07,43.69 53.09,42.67 v58.27,42.67
N$38  (via drill 0.33)
  Top 0.305: U$3.3 48.84,40.71 v49.02,40.89 | v54.81,41.81 55.02,41.99 55.07,42.04
  Top 0.406: U$4.14 54.57,41.62 v54.81,41.81 55.07,42.04 57.91,42.04 58.67,41.15 59.35,41.15 R30.1
  Bottom 0.305: v49.02,40.89 49.02,42.16 50.04,43.18 51.82,43.18 52.83,42.16 54.08,42.16 v54.81,41.81
N$39  (via drill 0.33)
  Top 0.305: U$3.1 46.29,40.07 v46.48,39.88
  Top 0.406: U$4.12 55.87,41.14 56.13,41.4 57.15,41.4 v57.53,41.27 57.91,40.89 57.91,39.88 58.93,38.86 R43.1
  Bottom 0.305: v46.48,39.88 47.75,39.88 48.01,40.13 49.28,40.13 49.78,40.64 49.78,42.16 50.29,42.67 51.56,42.67 53.09,41.15 57.15,41.15 v57.53,41.27
N$40  (via drill 0.33)
  Top 0.305: U$7.6 54.8,28.13 55.63,28.96 55.63,29.72 v55.88,29.97
  Top 0.406: U$4.9 55.87,33.79 56.13,33.53 v56.64,33.53 56.9,33.53 57.4,34.04 57.4,36.32 57.91,36.83 R44.1
  Bottom 0.305: v55.88,29.97 55.88,30.73 56.64,31.5 v56.64,33.53
N$41  (via drill 0.33)
  Top 0.305: U$7.4 52.9,28.64 v51.56,29.97
  Top 0.406: U$4.7 54.57,33.31 55.12,32.77 v55.37,32.77 57.15,32.77 58.17,33.78 58.17,34.54 58.42,34.8 R45.1
  Bottom 0.305: v51.56,29.97 53.85,29.97 55.37,31.5 v55.37,32.77
N$42  (via drill 0.33)
  Top 0.305: U$7.3 52.9,30.55 v53.09,30.73
  Top 0.406: U$4.5 53.27,33.34 v54.61,32 55.37,32 57.66,32 58.42,32.77 R46.1
  Bottom 0.305: v53.09,30.73 53.34,30.73 v54.61,32
N$43
  Top 0.305: U$7.1 54.8,30.67 54.86,30.73
  Top 0.406: U$4.3 51.97,33.63 54.86,30.73 R47.1
PGM_GPO  (via drill 0.33)
  Top 0.254: U4.1 58.12,29.42 v58.17,29.46 | v32,28.19 32.77,28.19 33.53,28.96 34.71,28.96 U$9.31
  Route2 0.254: v38.35,24.89 35.31,24.89 v32,28.19
  Route15 0.254: v58.17,29.46 58.17,25.65 57.66,25.15 38.61,25.15 v38.35,24.89
PGM_OUT
  Top 0.406: U$1.P18 68.65,28.48 58.92,28.48 U4.3
RAW_+12V  (via drill 0.9)
  Top 1.676: 21.81,54.61 L2.2
  Top 1.778: v17.27,58.93 17.27,56.64 19.3,54.61 21.81,54.61
  Bottom 1.676: 17.78,59.44 v17.27,58.93
  Bottom 1.778: U$1.P24 70.87,57.66 69.09,59.44 17.78,59.44
SAFE_+12V  (via drill 0.33)
  Top 0.406: R37.1 54.86,15.49 v55.12,15.24 | R36.2 60.96,26.67 62.23,26.67 v62.74,27.18
  Bottom 0.406: v55.12,15.24 62.74,15.24 63.5,16 67.31,16 68.07,16.76 68.07,28.7 | 68.07,28.7 68.07,53.34 67.06,54.36 44.96,54.36 43.94,55.37 v39.37,55.37 | v62.74,27.18 62.74,27.43 63.75,28.45 67.82,28.45 68.07,28.7
  pour Top (isolate 0.254, rank 3, no thermals): 42.16,49.78 42.93,49.78 42.93,52.58 40.13,55.37 40.13,58.42 38.1,59.94 28.19,59.94 24.13,55.88 24.13,55.63 23.88,55.37 23.88,54.1 26.16,54.1 27.43,55.63 38.1,55.63 42.16,51.31
STATUS_LED_1  (via drill 0.33)
  Top 0.305: U$9.27 33,31.01 v32.26,31.75
  Bottom 0.305: v32.26,31.75 32,31.75 31.75,32 28.7,32 27.94,31.24 27.94,6.6 23.88,2.54 10.92,2.54 9.91,3.56 U$6.4
STATUS_LED_2  (via drill 0.33)
  Top 0.305: U$9.26 33.52,31.51 32.26,32.77 v31.32,32.77
  Bottom 0.305: v31.32,32.77 28.45,32.77 27.18,31.5 27.18,6.86 25.4,5.08 14.99,5.08 13.46,3.56 U$6.6
SWCLK  (via drill 0.33)
  Top 0.254: U$9.45 42.64,25.18 43.94,23.88 44.7,23.88 45.72,22.86 45.97,22.86 v46.23,22.61 | TC2.4 34.42,15.49 v34.29,15.24 33.53,14.48 29.46,14.48 29.21,14.73 29.21,16 28.96,16.26 R10.2
  Route15 0.254: v45.97,17.78 45.97,16.76 44.96,15.75 40.13,15.75 38.61,14.22 35.31,14.22 v34.29,15.24
  Bottom 0.254: v46.23,22.61 46.23,21.84 45.97,21.59 v45.97,17.78
SWDIO  (via drill 0.33)
  Top 0.254: R9.2 28.79,13.97 34.8,13.97 36.58,15.75 TC2.2 37.72,15.24 v37.85,15.24 | U$9.44 42.14,25.17 42.16,24.89 43.69,23.37 44.2,23.37 v44.96,22.61
  Route15 0.254: v44.96,17.78 44.96,16.76 44.7,16.51 39.12,16.51 v37.85,15.24
  Bottom 0.254: v44.96,22.61 v44.96,17.78
TACH_GPO  (via drill 0.33)
  Top 0.254: U$9.33 36.64,27.63 36.32,27.94 v36.32,29.21 | v55.63,27.18 55.12,26.67 55.12,26.25 R35.1
  Bottom 0.254: v36.32,29.21 36.32,25.91 36.58,25.65 54.1,25.65 v55.63,27.18
TACH_OUT
  Top 0.305: R36.1 59.65,23.66 59.18,24.13 59.18,24.98 T1.C
  Top 0.406: R36.1 61.25,23.66 63.75,26.16 65.15,26.16 U$1.P7
TPS_ADC  (via drill 0.33)
  Top 0.254: RN1.2 44.56,8.02 v44.45,8.13 43.41,8.13 RN2.7
  Top 0.305: U$9.17 34.76,37.05 v34.8,37.08
  Bottom 0.305: v34.8,37.08 35.05,36.58 35.05,25.15 40.64,21.34 40.64,9.4 42.16,8.13 v44.45,8.13
TPS_IN
  Top 0.406: 61.24,9.78 R16.2 61.37,9.65 65.15,9.65 U$1.P11
VBATT_ADC  (via drill 0.33)
  Top 0.305: R37.2 51.22,16.6 50.8,17.02 v49.53,17.02 | U$9.16 35.78,37.88 v35.31,38.35
  Top 0.356: R38.1 51.05,13.63 C45.1 R37.2
  Route2 0.305: v49.53,17.02 49.53,36.58 47.75,38.35 v35.31,38.35
VBUS
  Top 0.406: X1.1 10.07,31.57 D1.A
  Top 0.61: D1.A 11.16,28.74 C14.+ 10.12,28.07 R4.2
VCC  (via drill 0.6)
  Top 0.813: C1.+ 30.53,47.98 IC2.3 30.45,45.24 v30.48,45.21 | v23.37,11.43 23.62,11.43 23.88,11.18 23.88,8.43 | 23.88,8.43 U$2.16 | R6.2 R31.2 28.19,8.04 28.19,6.35 27.94,6.1 24.89,6.1 23.88,7.11 23.88,8.43
  Bottom 1.016: v30.48,45.21 28.96,45.21 27.94,44.2 27.94,34.29 25.65,32 25.65,18.29 23.37,16 v23.37,11.43
VDD  (via drill 0.6)
  Top 0.813: v42.93,45.72 43.46,46 IC3.1 44.15,48.49 C24.+ | C2.+ 36.17,46.97 35.59,47.55 IC2.1 35.05,47.52 35.05,45.97 v34.04,44.96 | L3.P$1 54.19,55.76 R27.1 54.19,50.13 v54.1,50.04
  Bottom 0.813: v54.1,50.04 54.1,49.78 52.83,48.51 45.72,48.51 v42.93,45.72 41.91,44.7 34.29,44.7 v34.04,44.96
  pour Top (no thermals): 54.61,53.34 52.32,53.34 52.32,59.94 60.45,59.94 61.47,58.93 61.47,57.4 55.88,57.4 55.88,56.13 54.86,55.12 54.86,53.34
VREF
  Top 0.813: D2.C 77.72,54.61 75.69,52.58 75.69,18.52 U$1.P15
  Bottom 0.813: 70.88,13.72 U$1.P15
XMC_RESET  (via drill 0.33)
  Top 0.254: U$9.43 41.64,23.39 41.66,23.37 42.67,22.61 v43.69,22.61 | v31.75,15.24 31.75,16.13 TC2.10
  Route15 0.254: v43.69,17.78 39.12,17.78 38.61,18.29 37.34,18.29 36.83,17.78 34.29,17.78 v31.75,15.24
  Bottom 0.254: v43.69,22.61 v43.69,17.78
(copper drawn outside any net)
  shapes: Top circle x4

### Text on the board
tPlace: www.autosportlabs.net | Rev B | Copyright 2010-2015 Autosport Labs - All Rights Reserved
bPlace: Megajolt/C